# EasyEDA Pro project 2025-04-22-OSSC PRO HW with layout-v00.epro

# Schematic afe_audio
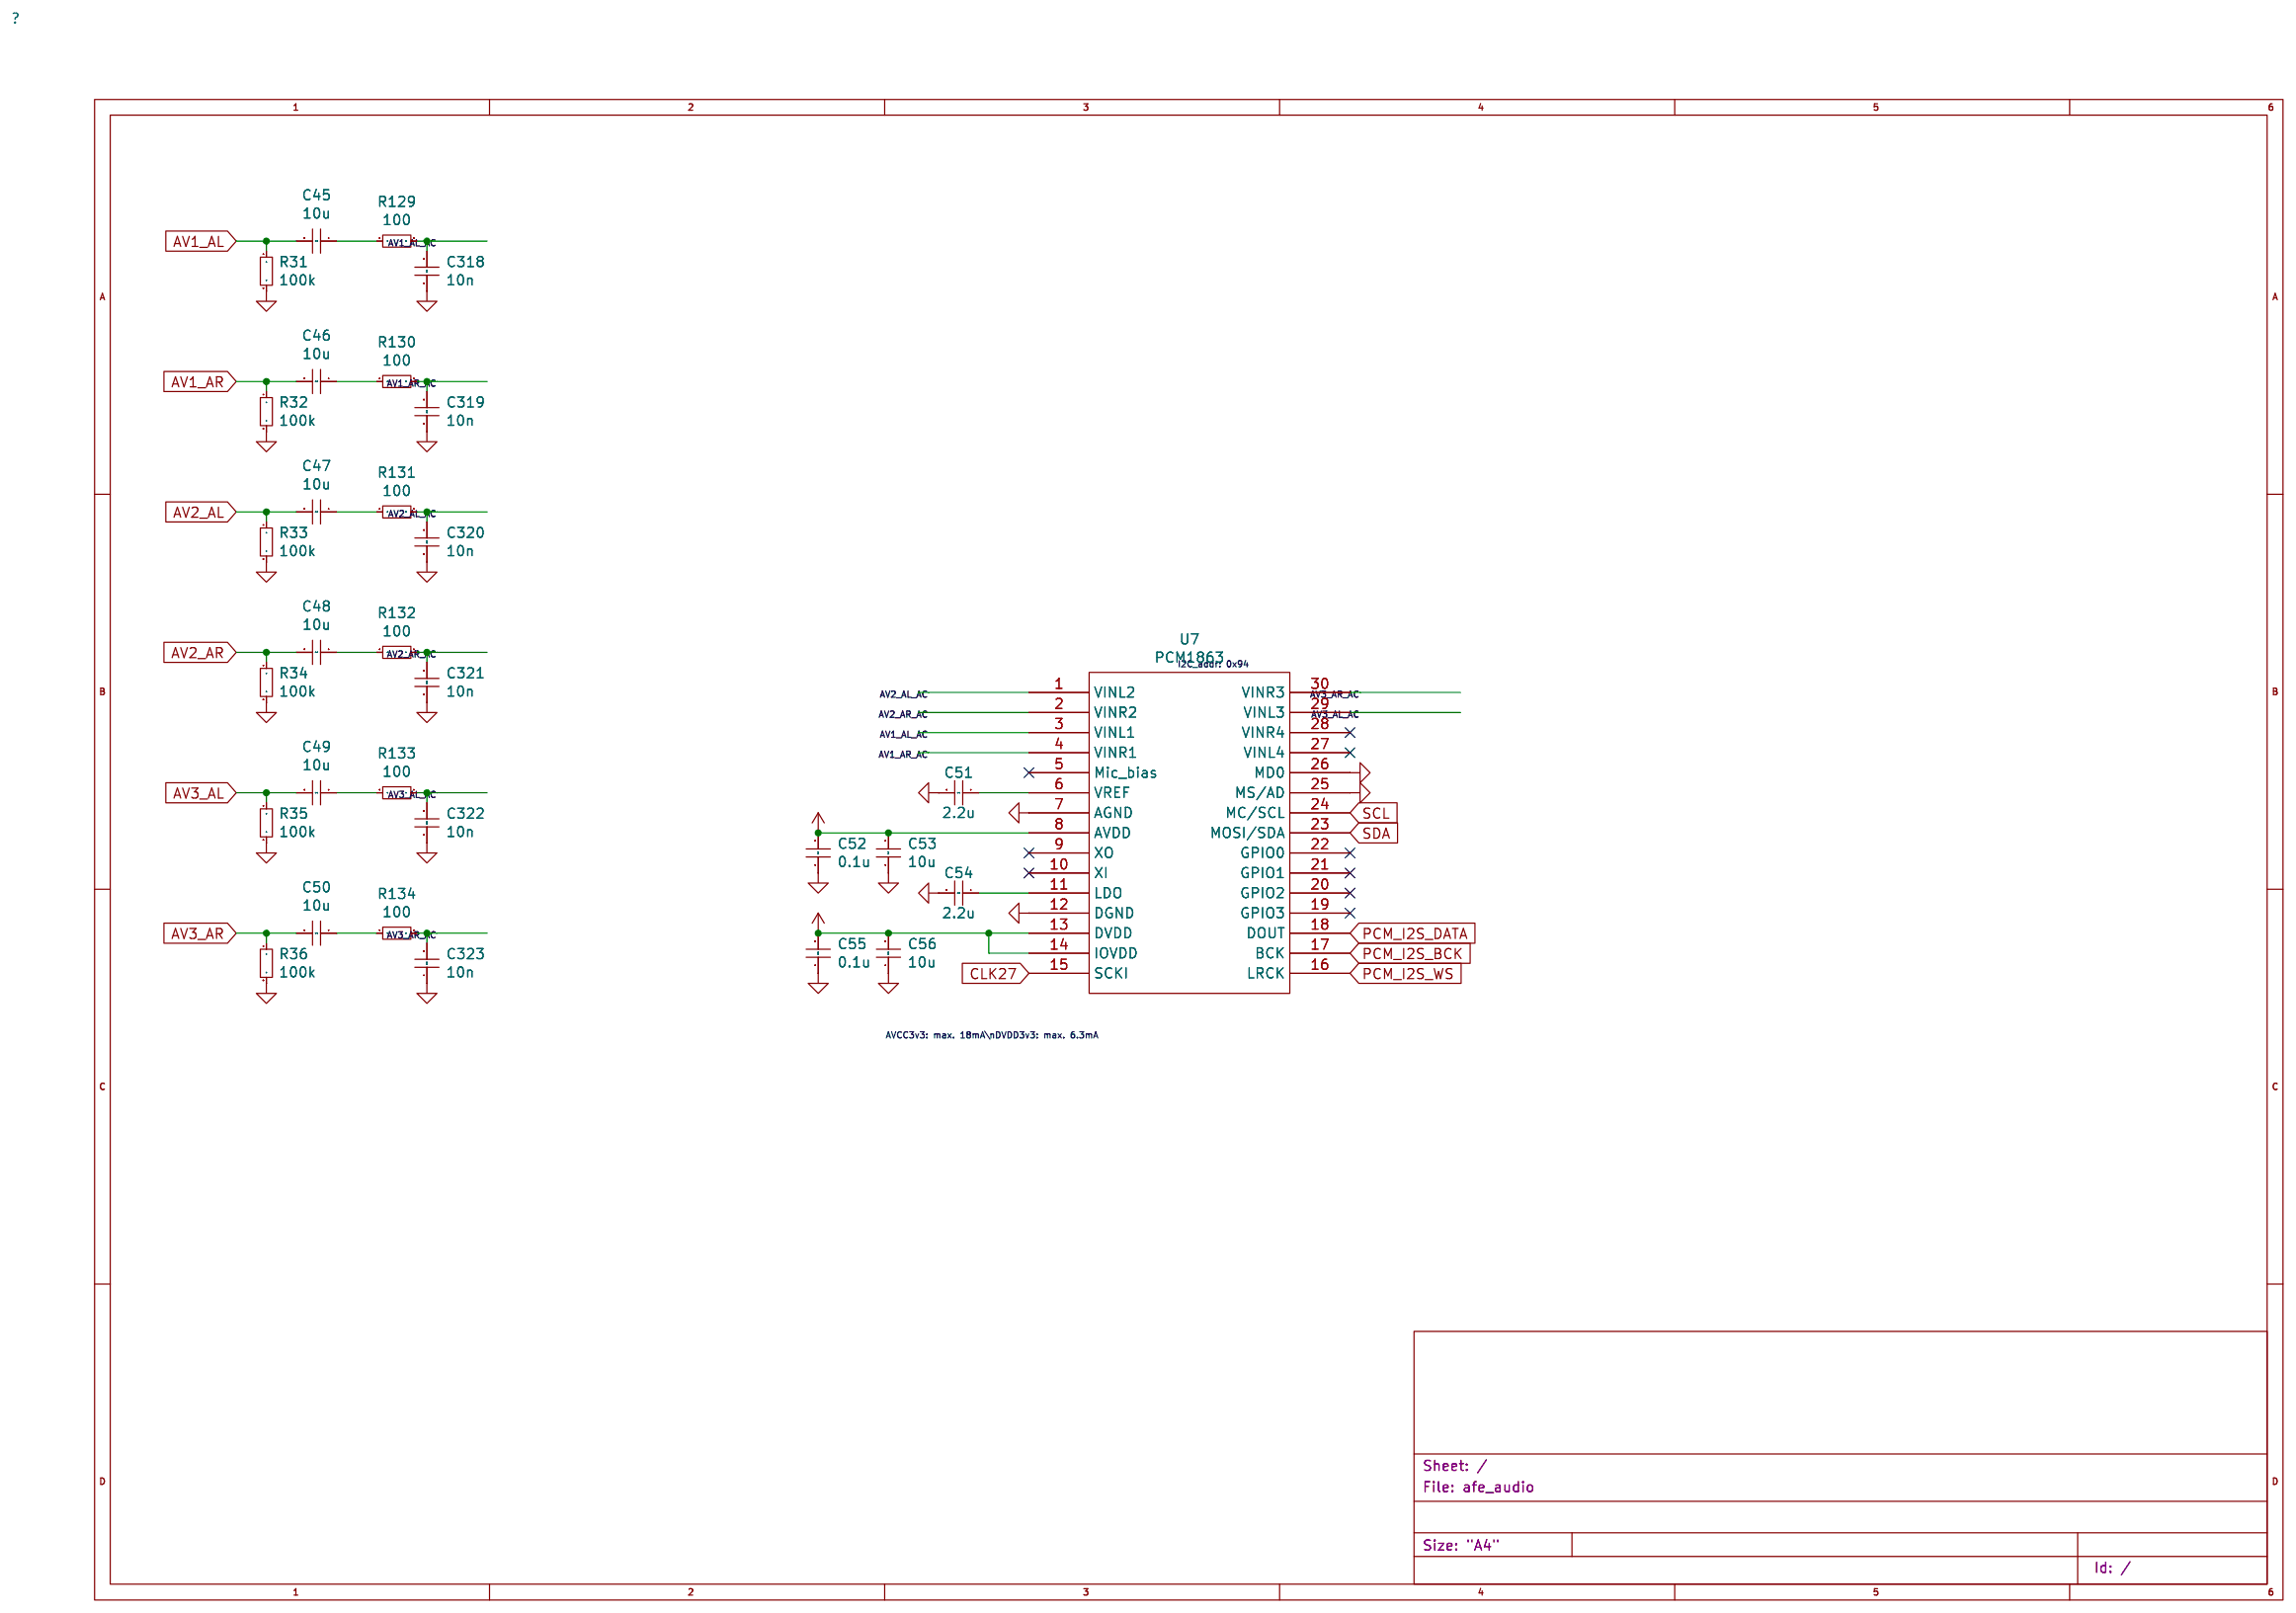
[diagram p0: schematic sheet]

## Parts
C45  10u
C46  10u
C47  10u
C48  10u
C49  10u
C50  10u
C51  2.2u
C52  0.1u
C53  10u
C54  2.2u
C55  0.1u
C56  10u
C318  10n
C319  10n
C320  10n
C321  10n
C322  10n
C323  10n
R31  100k
R32  100k
R33  100k
R34  100k
R35  100k
R36  100k
R129  100
R130  100
R131  100
R132  100
R133  100
R134  100
U7  PCM1863  [Package_SO:TSSOP-30_4.4x7.8mm_P0.5mm]

## Library data of the parts
C45-C56 C318-C323 = Device_C_Small
R31-R36 R129-R134 = Device_R_Small
U7 = custom_components_PCM1862: User doc link: DOCUMENTATION

## Nets
AV1_AL: C45.2 R31.1
AV1_AL_AC: C318.2 R129.1 U7.3(VINL1)
AV1_AR: C46.2 R32.1
AV1_AR_AC: C319.2 R130.1 U7.4(VINR1)
AV2_AL: C47.2 R33.1
AV2_AL_AC: C320.2 R131.1 U7.1(VINL2)
AV2_AR: C48.2 R34.1
AV2_AR_AC: C321.2 R132.1 U7.2(VINR2)
AV3_AL: C49.2 R35.1
AV3_AL_AC: C322.2 R133.1 U7.29(VINL3)
AV3_AR: C50.2 R36.1
AV3_AR_AC: C323.2 R134.1 U7.30(VINR3)
CLK27: U7.15(SCKI)
CUSTOM_COMPONENTS_AVCC3V3: C52.2 C53.2 U7.8(AVDD)
CUSTOM_COMPONENTS_DVDD3V3: C55.2 C56.2 U7.13(DVDD) U7.14(IOVDD)
PCM_I2S_BCK: U7.17(BCK)
PCM_I2S_DATA: U7.18(DOUT)
PCM_I2S_WS: U7.16(LRCK)
POWER_GND: C51.2 C52.1 C53.1 C54.2 C55.1 C56.1 C318.1 C319.1 C320.1 C321.1 C322.1 C323.1 R31.2 R32.2 R33.2 R34.2 R35.2 R36.2 U7.7(AGND) U7.12(DGND) U7.25(MS/AD) U7.26(MD0)
SCL: U7.24(MC/SCL)
SDA: U7.23(MOSI/SDA)
Net-(C45-1): C45.1 R129.2
Net-(C46-1): C46.1 R130.2
Net-(C47-1): C47.1 R131.2
Net-(C48-1): C48.1 R132.2
Net-(C49-1): C49.1 R133.2
Net-(C50-1): C50.1 R134.2
Net-(C51-1): C51.1 U7.6(VREF)
Net-(C54-1): C54.1 U7.11(LDO)

Not connected (* = marked no-connect by the designer): U7 5(Mic_bias)* 9(XO)* 10(XI)* 19(GPIO3)* 20(GPIO2)* 21(GPIO1)* 22(GPIO0)* 27(VINL4)* 28(VINR4)*

## Notes on the sheet
- I2C_addr: 0x94
- AVCC3v3: max. 18mA\nDVDD3v3: max. 6.3mA

# Schematic afe_rgb
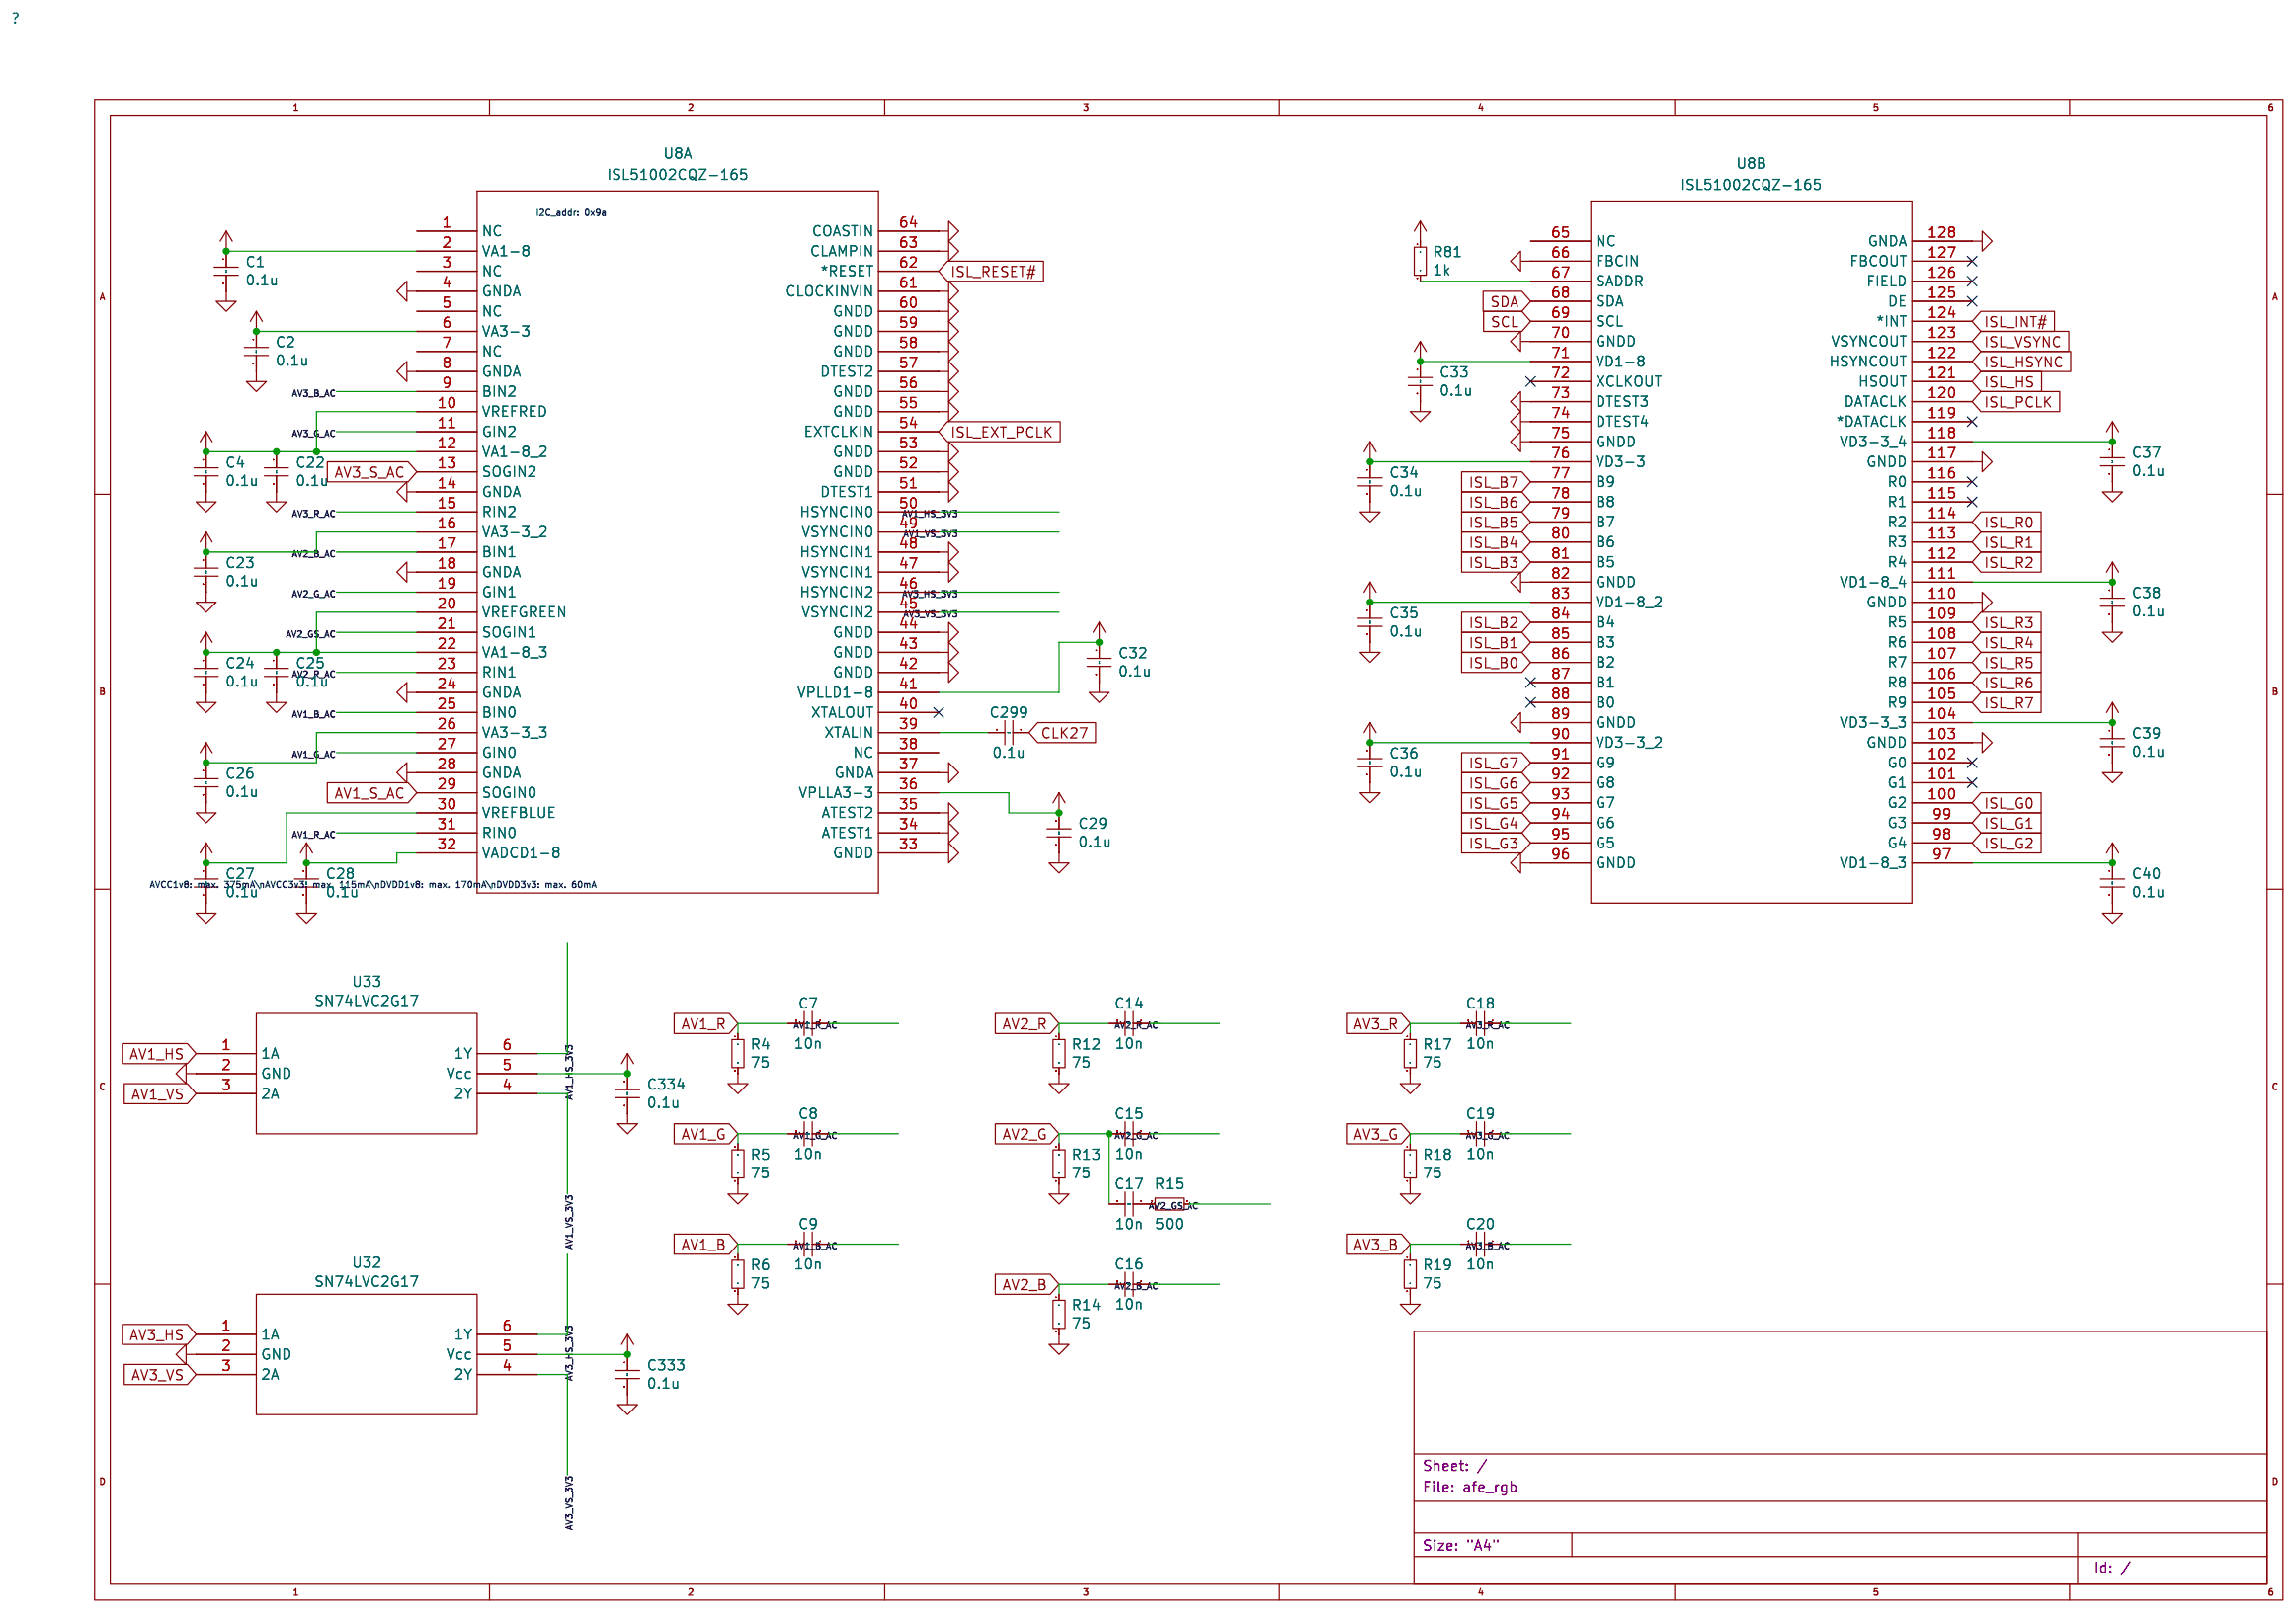
[diagram p1: schematic sheet]

## Parts
C1  0.1u
C2  0.1u
C4  0.1u
C7  10n
C8  10n
C9  10n
C14  10n
C15  10n
C16  10n
C17  10n
C18  10n
C19  10n
C20  10n
C22  0.1u
C23  0.1u
C24  0.1u
C25  0.1u
C26  0.1u
C27  0.1u
C28  0.1u
C29  0.1u
C32  0.1u
C33  0.1u
C34  0.1u
C35  0.1u
C36  0.1u
C37  0.1u
C38  0.1u
C39  0.1u
C40  0.1u
C299  0.1u
C333  0.1u
C334  0.1u
R4  75
R5  75
R6  75
R12  75
R13  75
R14  75
R15  500
R17  75
R18  75
R19  75
R81  1k
U8  ISL51002CQZ-165  (sections 1,2)
U32  SN74LVC2G17  [Package_TO_SOT_SMD:SC-70-8]
U33  SN74LVC2G17

## Library data of the parts
C1 C2 C4 C7-C9 C14-C20 C22-C29 C32-C40 C299 C333 C334 = Device_C_Small
R4-R6 R12-R15 R17-R19 R81 = Device_R_Small
U8 = custom_components_ISL51002CQZ-165
U32 = custom_components_SN74LVC2G17_1: User doc link: DOCUMENTATION
U33 = custom_components_SN74LVC2G17: User doc link: DOCUMENTATION

## Nets
AV1_B: C9.2 R6.1
AV1_B_AC: C9.1 U8.25(BIN0)
AV1_G: C8.2 R5.1
AV1_G_AC: C8.1 U8.27(GIN0)
AV1_HS: U33.1(1A)
AV1_HS_3V3: U8.50(HSYNCIN0) U33.6(1Y)
AV1_R: C7.2 R4.1
AV1_R_AC: C7.1 U8.31(RIN0)
AV1_S_AC: U8.29(SOGIN0)
AV1_VS: U33.3(2A)
AV1_VS_3V3: U8.49(VSYNCIN0) U33.4(2Y)
AV2_B: C16.2 R14.1
AV2_B_AC: C16.1 U8.17(BIN1)
AV2_G: C15.2 C17.2 R13.1
AV2_G_AC: C15.1 U8.19(GIN1)
AV2_GS_AC: R15.1 U8.21(SOGIN1)
AV2_R: C14.2 R12.1
AV2_R_AC: C14.1 U8.23(RIN1)
AV3_B: C20.2 R19.1
AV3_B_AC: C20.1 U8.9(BIN2)
AV3_G: C19.2 R18.1
AV3_G_AC: C19.1 U8.11(GIN2)
AV3_HS: U32.1(1A)
AV3_HS_3V3: U8.46(HSYNCIN2) U32.6(1Y)
AV3_R: C18.2 R17.1
AV3_R_AC: C18.1 U8.15(RIN2)
AV3_S_AC: U8.13(SOGIN2)
AV3_VS: U32.3(2A)
AV3_VS_3V3: U8.45(VSYNCIN2) U32.4(2Y)
CLK27: C299.1
CUSTOM_COMPONENTS_AVCC1V8: C1.1 C4.1 C22.1 C24.1 C25.1 C27.1 U8.2(VA1-8) U8.10(VREFRED) U8.12(VA1-8_2) U8.20(VREFGREEN) U8.22(VA1-8_3) U8.30(VREFBLUE)
CUSTOM_COMPONENTS_AVCC3V3: C2.1 C23.1 C26.1 C29.1 U8.6(VA3-3) U8.16(VA3-3_2) U8.26(VA3-3_3) U8.36(VPLLA3-3)
CUSTOM_COMPONENTS_DVDD1V8: C28.1 C32.1 C33.1 C35.1 C38.1 C40.1 U8.32(VADCD1-8) U8.41(VPLLD1-8) U8.71(VD1-8) U8.83(VD1-8_2) U8.97(VD1-8_3) U8.111(VD1-8_4)
CUSTOM_COMPONENTS_DVDD3V3: C34.1 C36.1 C37.1 C39.1 C333.1 C334.1 R81.1 U8.76(VD3-3) U8.90(VD3-3_2) U8.104(VD3-3_3) U8.118(VD3-3_4) U32.5(Vcc) U33.5(Vcc)
ISL_B0: U8.86(B2)
ISL_B1: U8.85(B3)
ISL_B2: U8.84(B4)
ISL_B3: U8.81(B5)
ISL_B4: U8.80(B6)
ISL_B5: U8.79(B7)
ISL_B6: U8.78(B8)
ISL_B7: U8.77(B9)
ISL_EXT_PCLK: U8.54(EXTCLKIN)
ISL_G0: U8.100(G2)
ISL_G1: U8.99(G3)
ISL_G2: U8.98(G4)
ISL_G3: U8.95(G5)
ISL_G4: U8.94(G6)
ISL_G5: U8.93(G7)
ISL_G6: U8.92(G8)
ISL_G7: U8.91(G9)
ISL_HS: U8.121(HSOUT)
ISL_HSYNC: U8.122(HSYNCOUT)
ISL_INT#: U8.124(*INT)
ISL_PCLK: U8.120(DATACLK)
ISL_R0: U8.114(R2)
ISL_R1: U8.113(R3)
ISL_R2: U8.112(R4)
ISL_R3: U8.109(R5)
ISL_R4: U8.108(R6)
ISL_R5: U8.107(R7)
ISL_R6: U8.106(R8)
ISL_R7: U8.105(R9)
ISL_RESET#: U8.62(*RESET)
ISL_VSYNC: U8.123(VSYNCOUT)
POWER_GND: C1.2 C2.2 C4.2 C22.2 C23.2 C24.2 C25.2 C26.2 C27.2 C28.2 C29.2 C32.2 C33.2 C34.2 C35.2 C36.2 C37.2 C38.2 C39.2 C40.2 C333.2 C334.2 R4.2 R5.2 R6.2 R12.2 R13.2 R14.2 R17.2 R18.2 R19.2 U8.4(GNDA) U8.8(GNDA) U8.14(GNDA) U8.18(GNDA) U8.24(GNDA) U8.28(GNDA) U8.33(GNDD) U8.34(ATEST1) U8.35(ATEST2) U8.37(GNDA) U8.42(GNDD) U8.43(GNDD) U8.44(GNDD) U8.47(VSYNCIN1) U8.48(HSYNCIN1) U8.51(DTEST1) U8.52(GNDD) U8.53(GNDD) U8.55(GNDD) U8.56(GNDD) U8.57(DTEST2) U8.58(GNDD) U8.59(GNDD) U8.60(GNDD) U8.61(CLOCKINVIN) U8.63(CLAMPIN) U8.64(COASTIN) U8.66(FBCIN) U8.70(GNDD) U8.73(DTEST3) U8.74(DTEST4) U8.75(GNDD) U8.82(GNDD) U8.89(GNDD) U8.96(GNDD) U8.103(GNDD) U8.110(GNDD) U8.117(GNDD) U8.128(GNDA) U32.2(GND) U33.2(GND)
SCL: U8.69(SCL)
SDA: U8.68(SDA)
Net-(C17-1): C17.1 R15.2
Net-(C299-2): C299.2 U8.39(XTALIN)
Net-(R81-2): R81.2 U8.67(SADDR)

Not connected (* = marked no-connect by the designer): U8 1(NC) 3(NC) 5(NC) 7(NC) 38(NC) 40(XTALOUT)* 65(NC) 72(XCLKOUT)* 87(B1)* 88(B0)* 101(G1)* 102(G0)* 115(R1)* 116(R0)* 119(*DATACLK)* 125(DE)* 126(FIELD)* 127(FBCOUT)*

## Notes on the sheet
- I2C_addr: 0x9a
- AVCC1v8: max. 375mA\nAVCC3v3: max. 115mA\nDVDD1v8: max. 170mA\nDVDD3v3: max. 60mA

# Schematic afe_syncmux
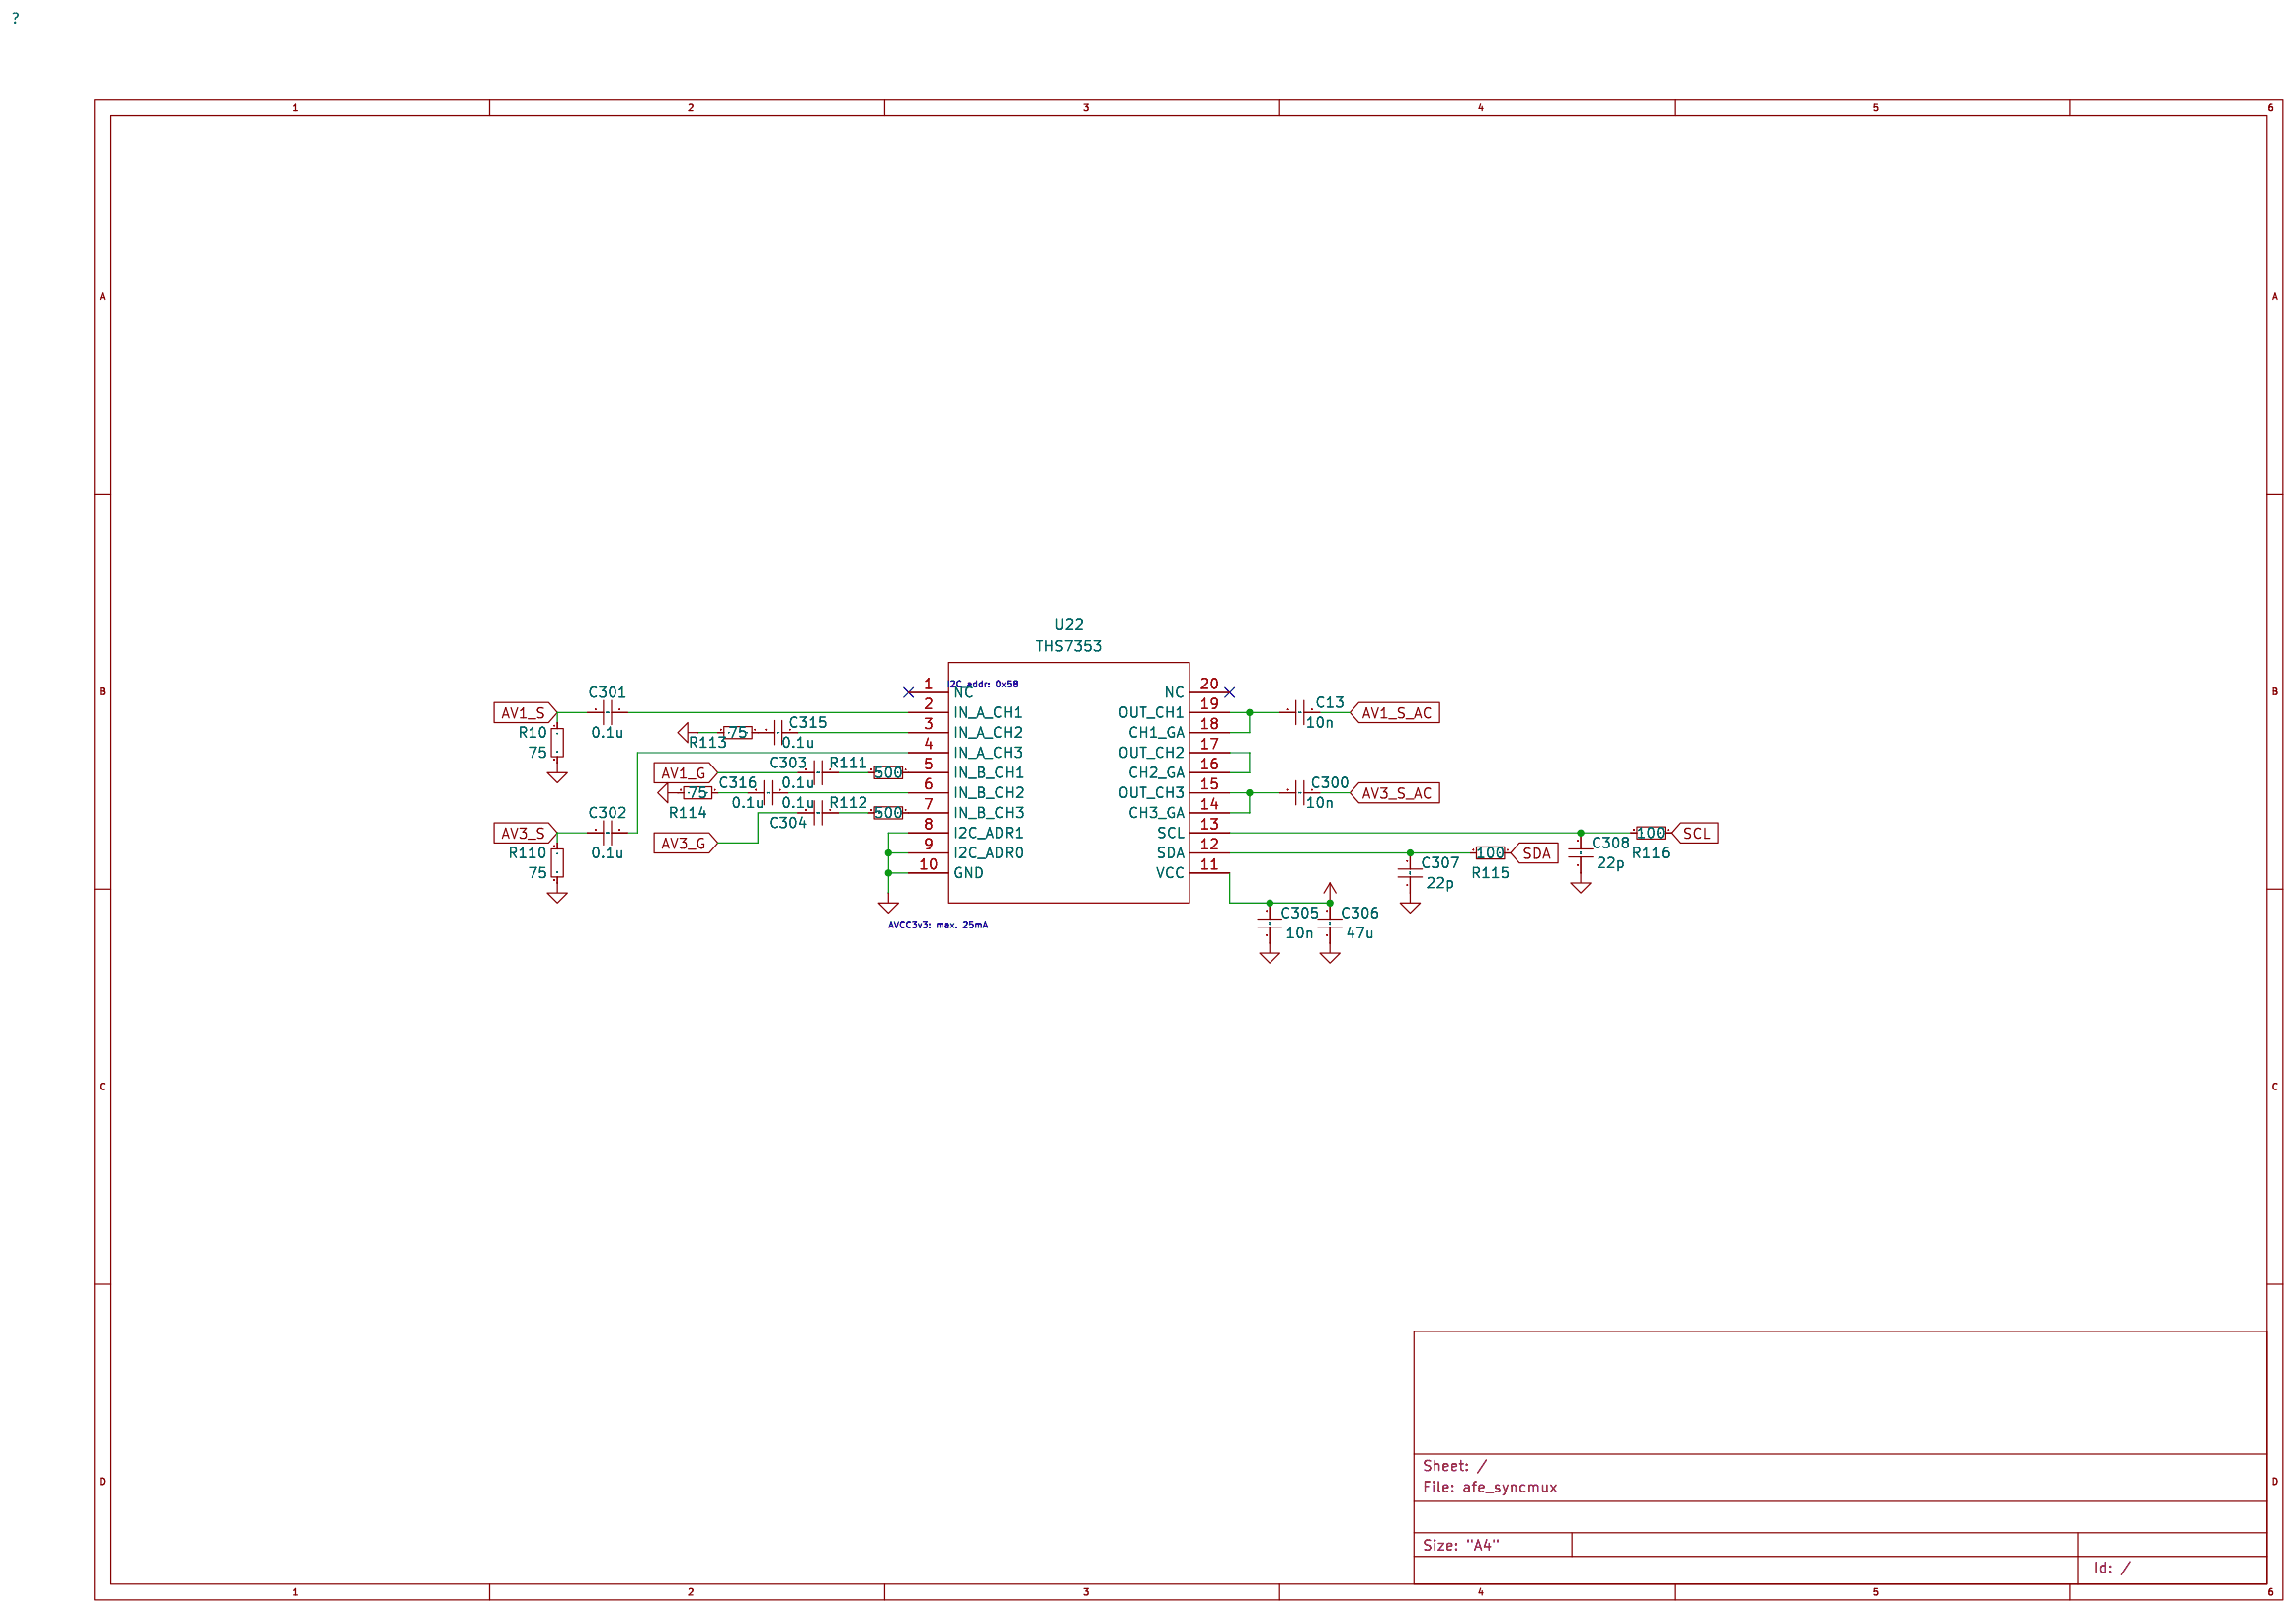
[diagram p2: schematic sheet]

## Parts
C13  10n
C300  10n
C301  0.1u
C302  0.1u
C303  0.1u
C304  0.1u
C305  10n
C306  47u
C307  22p
C308  22p
C315  0.1u
C316  0.1u
R10  75
R110  75
R111  500
R112  500
R113  75
R114  75
R115  100
R116  100
U22  THS7353  [Package_SO:TSSOP-20_4.4x6.5mm_P0.65mm]

## Library data of the parts
C13 C300-C308 C315 C316 = Device_C_Small
R10 R110-R116 = Device_R_Small
U22 = custom_components_THS7353

## Nets
AV1_G: C303.2
AV1_S: C301.2 R10.1
AV1_S_AC: C13.1
AV3_G: C304.2
AV3_S: C302.2 R110.1
AV3_S_AC: C300.1
CUSTOM_COMPONENTS_AVCC3V3: C305.2 C306.2 U22.11(VCC)
POWER_GND: C305.1 C306.1 C307.1 C308.1 R10.2 R110.2 R113.2 R114.2 U22.8(I2C_ADR1) U22.9(I2C_ADR0) U22.10(GND)
SCL: R116.1
SDA: R115.1
Net-(C13-2): C13.2 U22.18(CH1_GA) U22.19(OUT_CH1)
Net-(C300-2): C300.2 U22.14(CH3_GA) U22.15(OUT_CH3)
Net-(C301-1): C301.1 U22.2(IN_A_CH1)
Net-(C302-1): C302.1 U22.4(IN_A_CH3)
Net-(C303-1): C303.1 R111.2
Net-(C304-1): C304.1 R112.2
Net-(C307-2): C307.2 R115.2 U22.12(SDA)
Net-(C308-2): C308.2 R116.2 U22.13(SCL)
Net-(C315-1): C315.1 U22.3(IN_A_CH2)
Net-(C315-2): C315.2 R113.1
Net-(C316-1): C316.1 U22.6(IN_B_CH2)
Net-(C316-2): C316.2 R114.1
Net-(R111-1): R111.1 U22.5(IN_B_CH1)
Net-(R112-1): R112.1 U22.7(IN_B_CH3)
Net-(U22-16): U22.16(CH2_GA) U22.17(OUT_CH2)

Not connected (* = marked no-connect by the designer): U22 1(NC)* 20(NC)*

## Notes on the sheet
- I2C_addr: 0x58
- AVCC3v3: max. 25mA

# Schematic clock
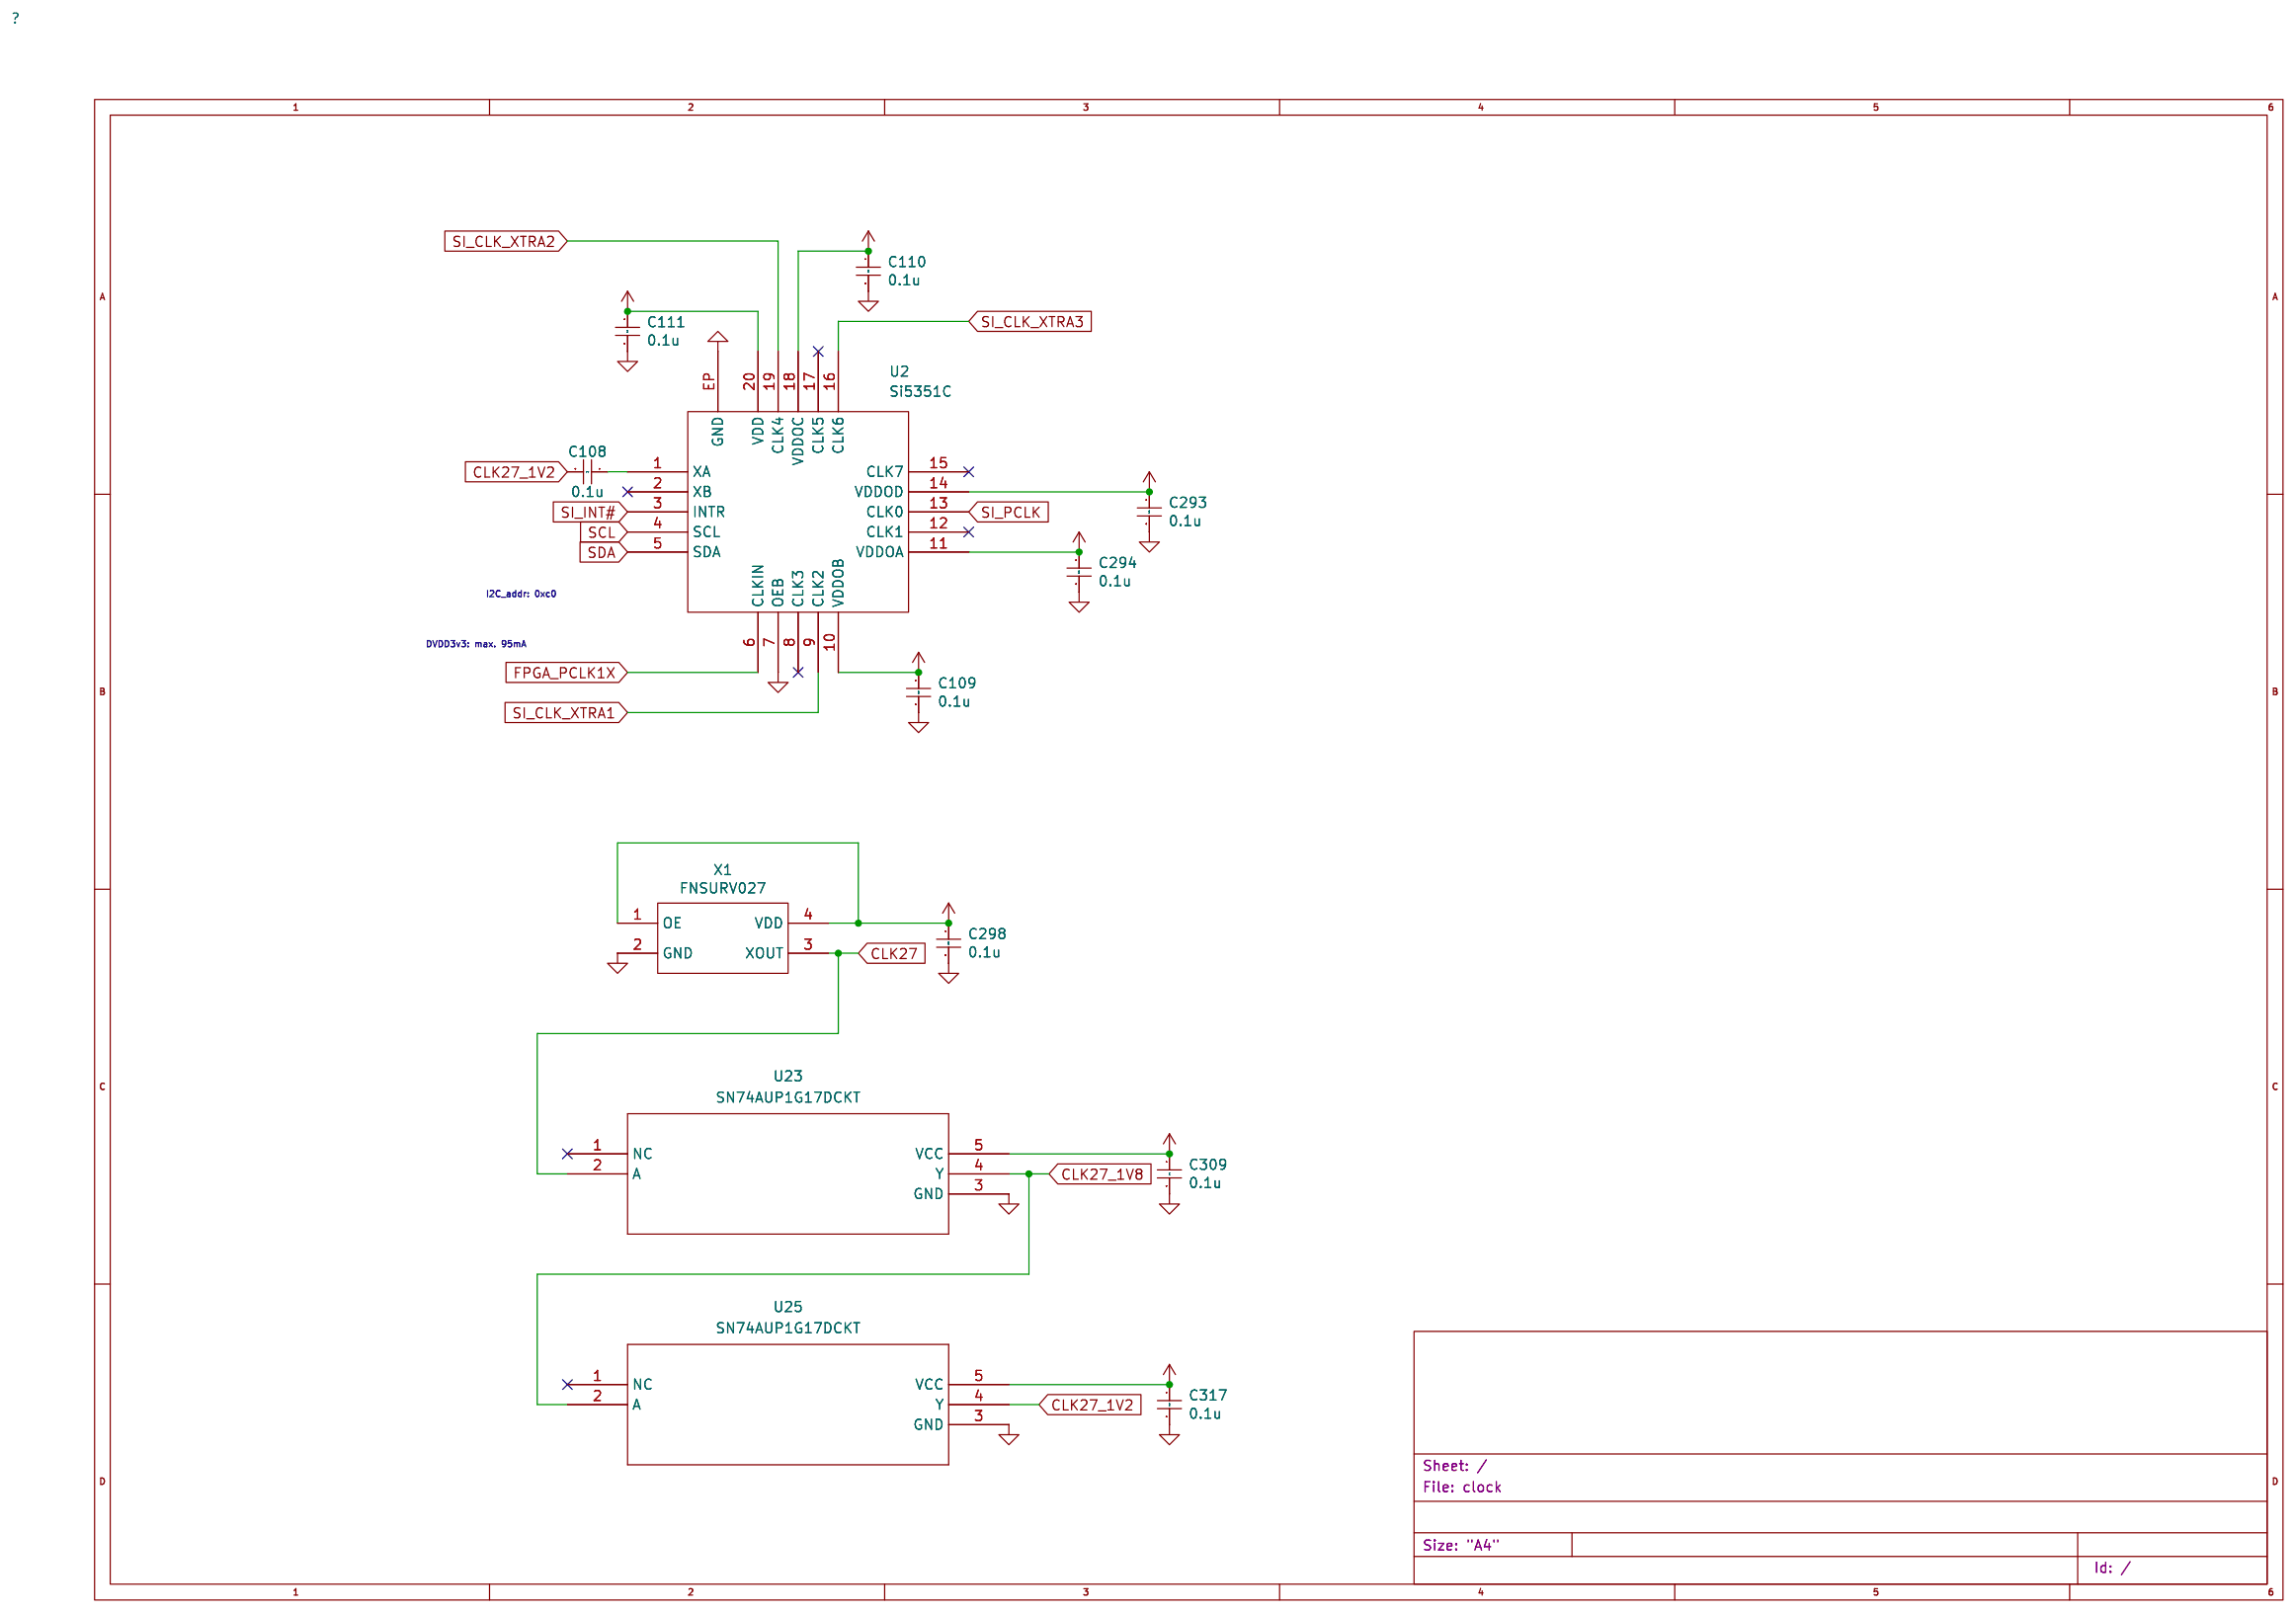
[diagram p3: schematic sheet]

## Parts
C108  0.1u
C109  0.1u
C110  0.1u
C111  0.1u
C293  0.1u
C294  0.1u
C298  0.1u
C309  0.1u
C317  0.1u
U2  Si5351C  [custom_components:QFN-20-1EP_4x4mm_Pitch0.5mm_Handsoldering]
U23  SN74AUP1G17DCKT
U25  SN74AUP1G17DCKT  [custom_components:SN74AUP1G17DCKT]
X1  FNSURV027  [Connector_PinHeader_2.54mm:PinHeader_2x02_P2.54mm_Vertical]

## Library data of the parts
C108-C111 C293 C294 C298 C309 C317 = Device_C_Small
U2 = custom_components_Si5351C
U23 = custom_components_SN74AUP1G17DCKT
U25 = custom_components_SN74AUP1G17DCKT_1
X1 = custom_components_FNSURV027

## Nets
CLK27: U23.2(A) X1.3(XOUT)
CLK27_1V2: C108.2 U25.4(Y)
CLK27_1V8: U23.4(Y) U25.2(A)
CUSTOM_COMPONENTS_DVDD1V2: C317.1 U25.5(VCC)
CUSTOM_COMPONENTS_DVDD1V8: C309.1 U23.5(VCC)
CUSTOM_COMPONENTS_DVDD3V3: C109.1 C110.1 C111.1 C293.1 C294.1 C298.1 U2.10(VDDOB) U2.11(VDDOA) U2.14(VDDOD) U2.18(VDDOC) U2.20(VDD) X1.1(OE) X1.4(VDD)
FPGA_PCLK1X: U2.6(CLKIN)
POWER_GND: C109.2 C110.2 C111.2 C293.2 C294.2 C298.2 C309.2 C317.2 U2.7(OEB) U2.EP(GND) U23.3(GND) U25.3(GND) X1.2(GND)
SCL: U2.4(SCL)
SDA: U2.5(SDA)
SI_CLK_XTRA1: U2.9(CLK2)
SI_CLK_XTRA2: U2.19(CLK4)
SI_CLK_XTRA3: U2.16(CLK6)
SI_INT#: U2.3(INTR)
SI_PCLK: U2.13(CLK0)
Net-(C108-1): C108.1 U2.1(XA)

Not connected (* = marked no-connect by the designer): U2 2(XB)* 8(CLK3)* 12(CLK1)* 15(CLK7)* 17(CLK5)*; U23 1(NC)*; U25 1(NC)*

## Notes on the sheet
- I2C_addr: 0xc0
- DVDD3v3: max. 95mA

# Schematic fpga1
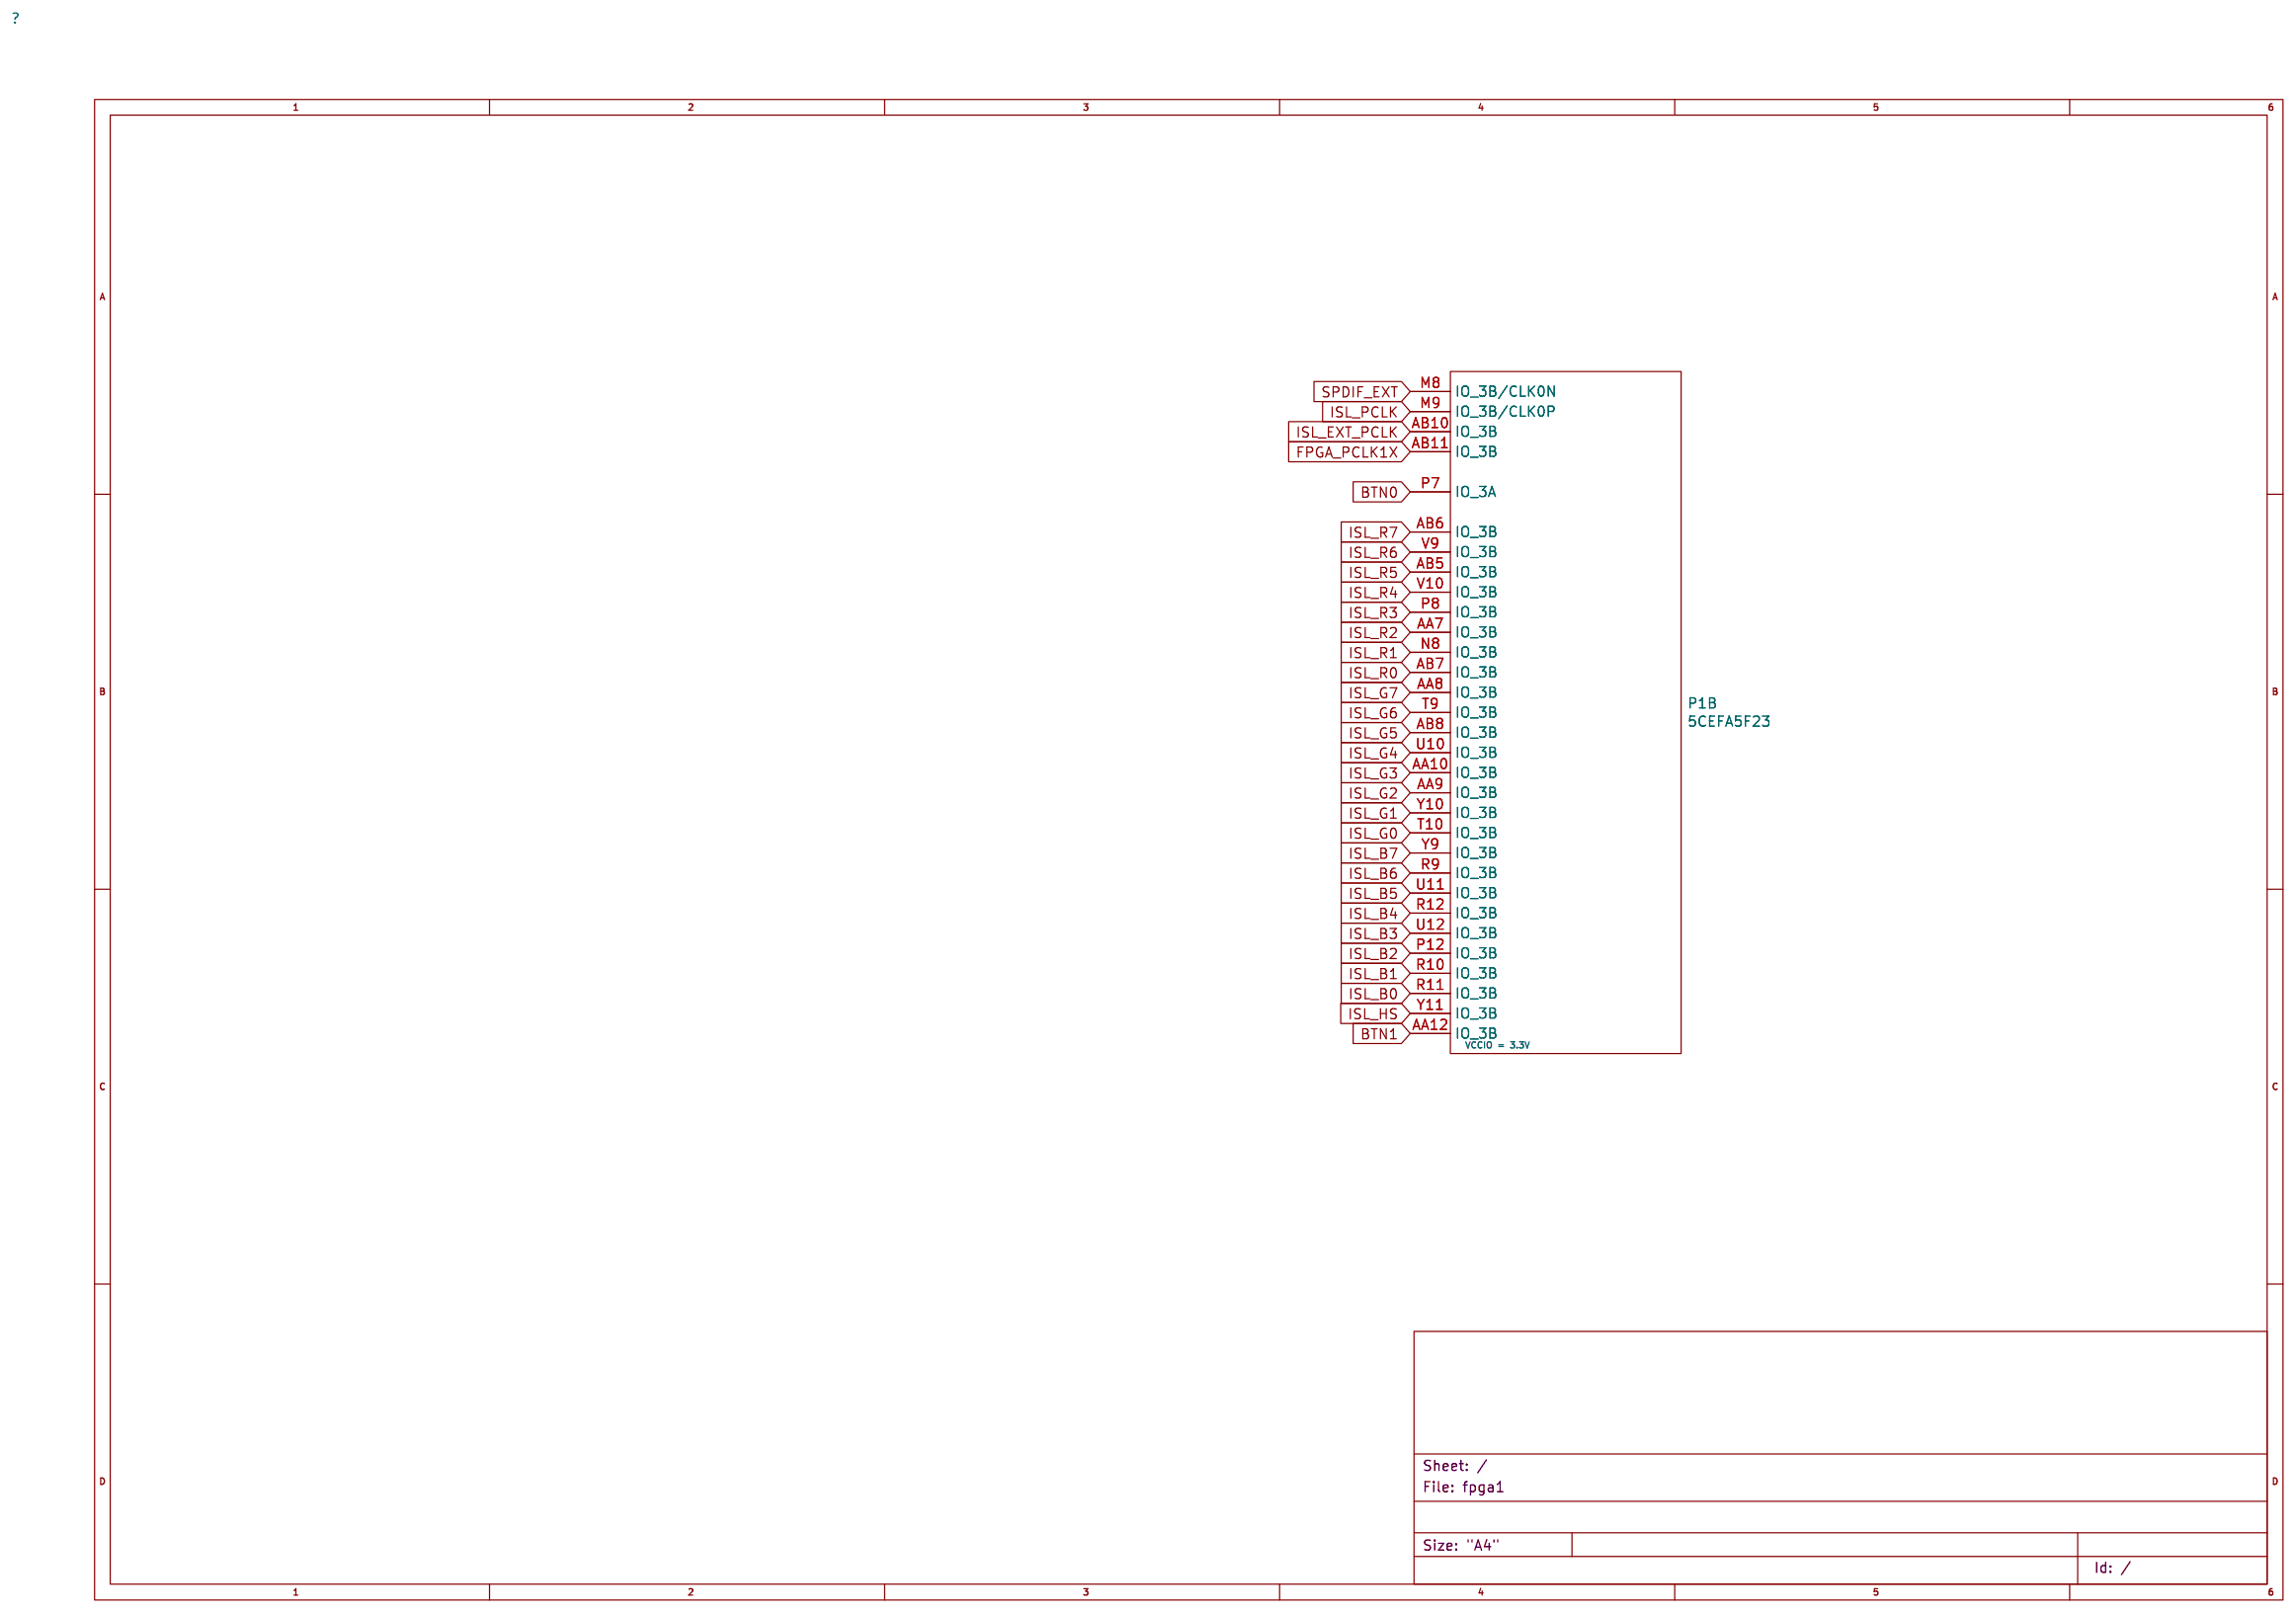
[diagram p4: schematic sheet]

## Parts
P1  5CEFA5F23  (section 2)

## Library data of the parts
P1 = custom_components_5CEFA5F23

## Nets
BTN0: P1.P7(IO_3A)
BTN1: P1.AA12(IO_3B)
FPGA_PCLK1X: P1.AB11(IO_3B)
ISL_B0: P1.R11(IO_3B)
ISL_B1: P1.R10(IO_3B)
ISL_B2: P1.P12(IO_3B)
ISL_B3: P1.U12(IO_3B)
ISL_B4: P1.R12(IO_3B)
ISL_B5: P1.U11(IO_3B)
ISL_B6: P1.R9(IO_3B)
ISL_B7: P1.Y9(IO_3B)
ISL_EXT_PCLK: P1.AB10(IO_3B)
ISL_G0: P1.T10(IO_3B)
ISL_G1: P1.Y10(IO_3B)
ISL_G2: P1.AA9(IO_3B)
ISL_G3: P1.AA10(IO_3B)
ISL_G4: P1.U10(IO_3B)
ISL_G5: P1.AB8(IO_3B)
ISL_G6: P1.T9(IO_3B)
ISL_G7: P1.AA8(IO_3B)
ISL_HS: P1.Y11(IO_3B)
ISL_PCLK: P1.M9(IO_3B/CLK0P)
ISL_R0: P1.AB7(IO_3B)
ISL_R1: P1.N8(IO_3B)
ISL_R2: P1.AA7(IO_3B)
ISL_R3: P1.P8(IO_3B)
ISL_R4: P1.V10(IO_3B)
ISL_R5: P1.AB5(IO_3B)
ISL_R6: P1.V9(IO_3B)
ISL_R7: P1.AB6(IO_3B)
SPDIF_EXT: P1.M8(IO_3B/CLK0N)

## Notes on the sheet
- VCCIO = 3.3V

# Schematic fpga2
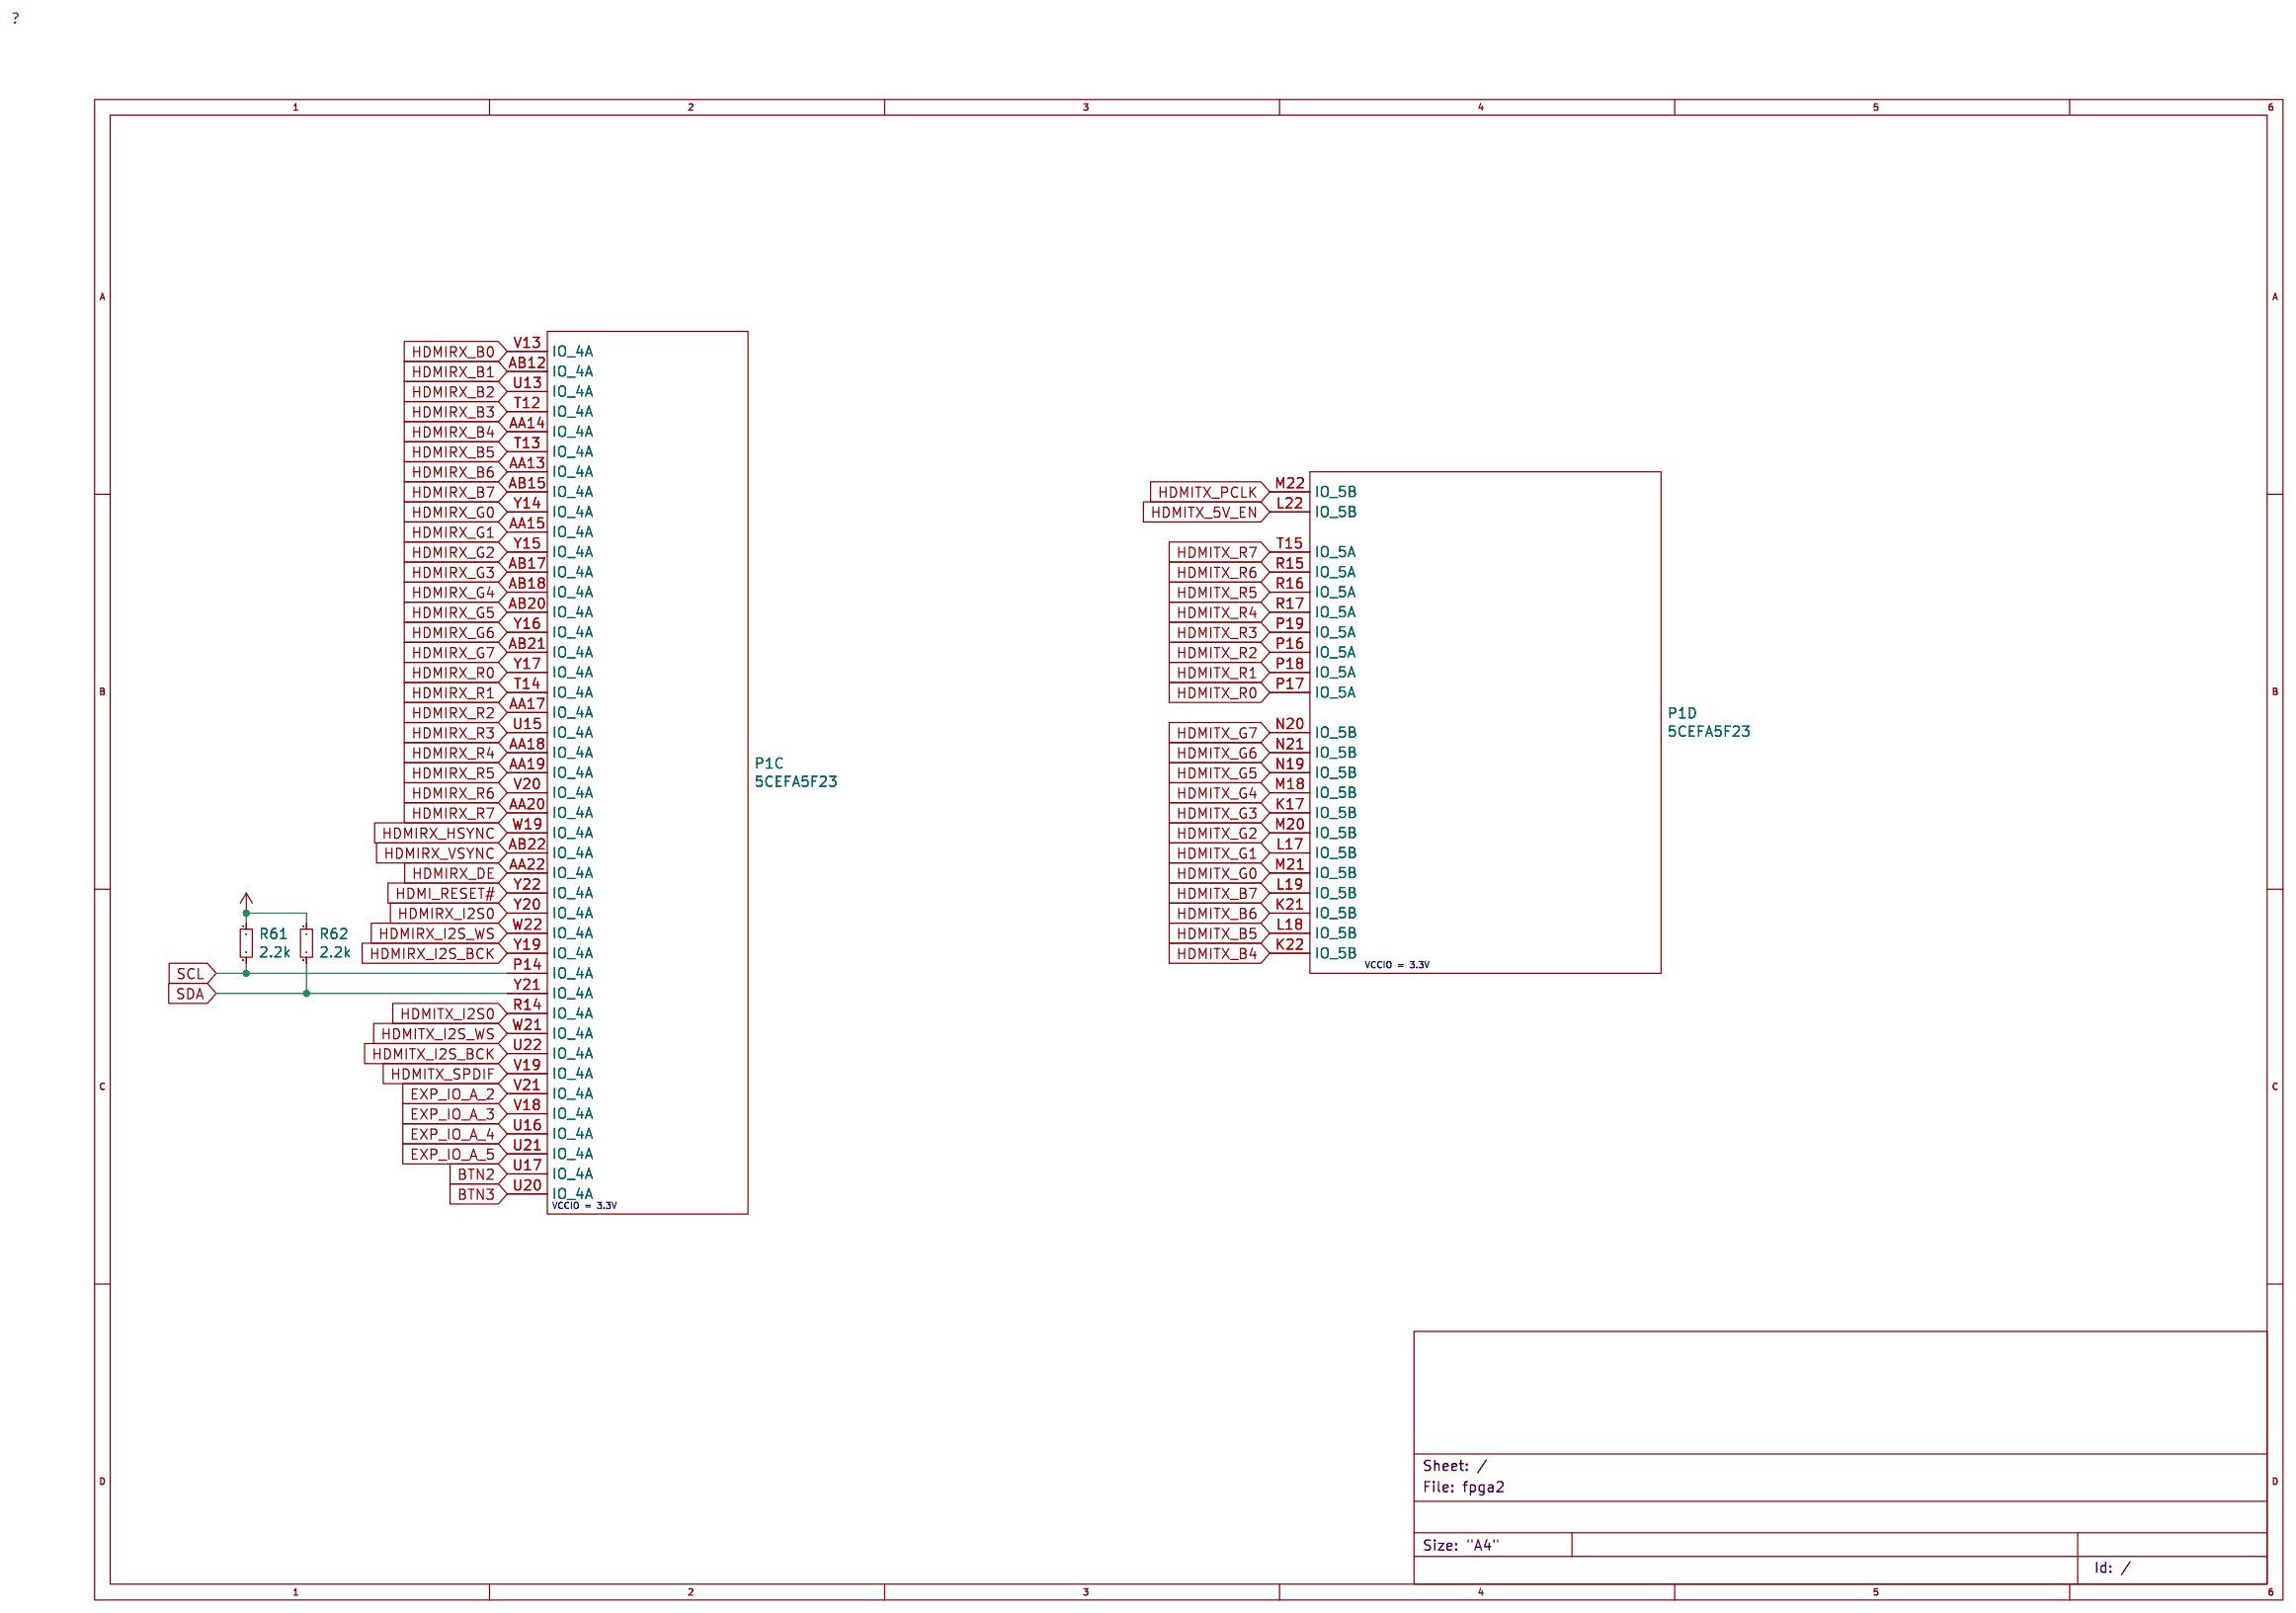
[diagram p5: schematic sheet]

## Parts
P1  5CEFA5F23  (sections 3,4)
R61  2.2k
R62  2.2k

## Library data of the parts
P1 = custom_components_5CEFA5F23
R61 R62 = Device_R_Small

## Nets
BTN2: P1.U17(IO_4A)
BTN3: P1.U20(IO_4A)
CUSTOM_COMPONENTS_DVDD3V3: R61.1 R62.1
EXP_IO_A_2: P1.V21(IO_4A)
EXP_IO_A_3: P1.V18(IO_4A)
EXP_IO_A_4: P1.U16(IO_4A)
EXP_IO_A_5: P1.U21(IO_4A)
HDMI_RESET#: P1.Y22(IO_4A)
HDMIRX_B0: P1.V13(IO_4A)
HDMIRX_B1: P1.AB12(IO_4A)
HDMIRX_B2: P1.U13(IO_4A)
HDMIRX_B3: P1.T12(IO_4A)
HDMIRX_B4: P1.AA14(IO_4A)
HDMIRX_B5: P1.T13(IO_4A)
HDMIRX_B6: P1.AA13(IO_4A)
HDMIRX_B7: P1.AB15(IO_4A)
HDMIRX_DE: P1.AA22(IO_4A)
HDMIRX_G0: P1.Y14(IO_4A)
HDMIRX_G1: P1.AA15(IO_4A)
HDMIRX_G2: P1.Y15(IO_4A)
HDMIRX_G3: P1.AB17(IO_4A)
HDMIRX_G4: P1.AB18(IO_4A)
HDMIRX_G5: P1.AB20(IO_4A)
HDMIRX_G6: P1.Y16(IO_4A)
HDMIRX_G7: P1.AB21(IO_4A)
HDMIRX_HSYNC: P1.W19(IO_4A)
HDMIRX_I2S0: P1.Y20(IO_4A)
HDMIRX_I2S_BCK: P1.Y19(IO_4A)
HDMIRX_I2S_WS: P1.W22(IO_4A)
HDMIRX_R0: P1.Y17(IO_4A)
HDMIRX_R1: P1.T14(IO_4A)
HDMIRX_R2: P1.AA17(IO_4A)
HDMIRX_R3: P1.U15(IO_4A)
HDMIRX_R4: P1.AA18(IO_4A)
HDMIRX_R5: P1.AA19(IO_4A)
HDMIRX_R6: P1.V20(IO_4A)
HDMIRX_R7: P1.AA20(IO_4A)
HDMIRX_VSYNC: P1.AB22(IO_4A)
HDMITX_5V_EN: P1.L22(IO_5B)
HDMITX_B4: P1.K22(IO_5B)
HDMITX_B5: P1.L18(IO_5B)
HDMITX_B6: P1.K21(IO_5B)
HDMITX_B7: P1.L19(IO_5B)
HDMITX_G0: P1.M21(IO_5B)
HDMITX_G1: P1.L17(IO_5B)
HDMITX_G2: P1.M20(IO_5B)
HDMITX_G3: P1.K17(IO_5B)
HDMITX_G4: P1.M18(IO_5B)
HDMITX_G5: P1.N19(IO_5B)
HDMITX_G6: P1.N21(IO_5B)
HDMITX_G7: P1.N20(IO_5B)
HDMITX_I2S0: P1.R14(IO_4A)
HDMITX_I2S_BCK: P1.U22(IO_4A)
HDMITX_I2S_WS: P1.W21(IO_4A)
HDMITX_PCLK: P1.M22(IO_5B)
HDMITX_R0: P1.P17(IO_5A)
HDMITX_R1: P1.P18(IO_5A)
HDMITX_R2: P1.P16(IO_5A)
HDMITX_R3: P1.P19(IO_5A)
HDMITX_R4: P1.R17(IO_5A)
HDMITX_R5: P1.R16(IO_5A)
HDMITX_R6: P1.R15(IO_5A)
HDMITX_R7: P1.T15(IO_5A)
HDMITX_SPDIF: P1.V19(IO_4A)
SCL: P1.P14(IO_4A) R61.2
SDA: P1.Y21(IO_4A) R62.2

## Notes on the sheet
- VCCIO = 3.3V
- VCCIO = 3.3V

# Schematic fpga3
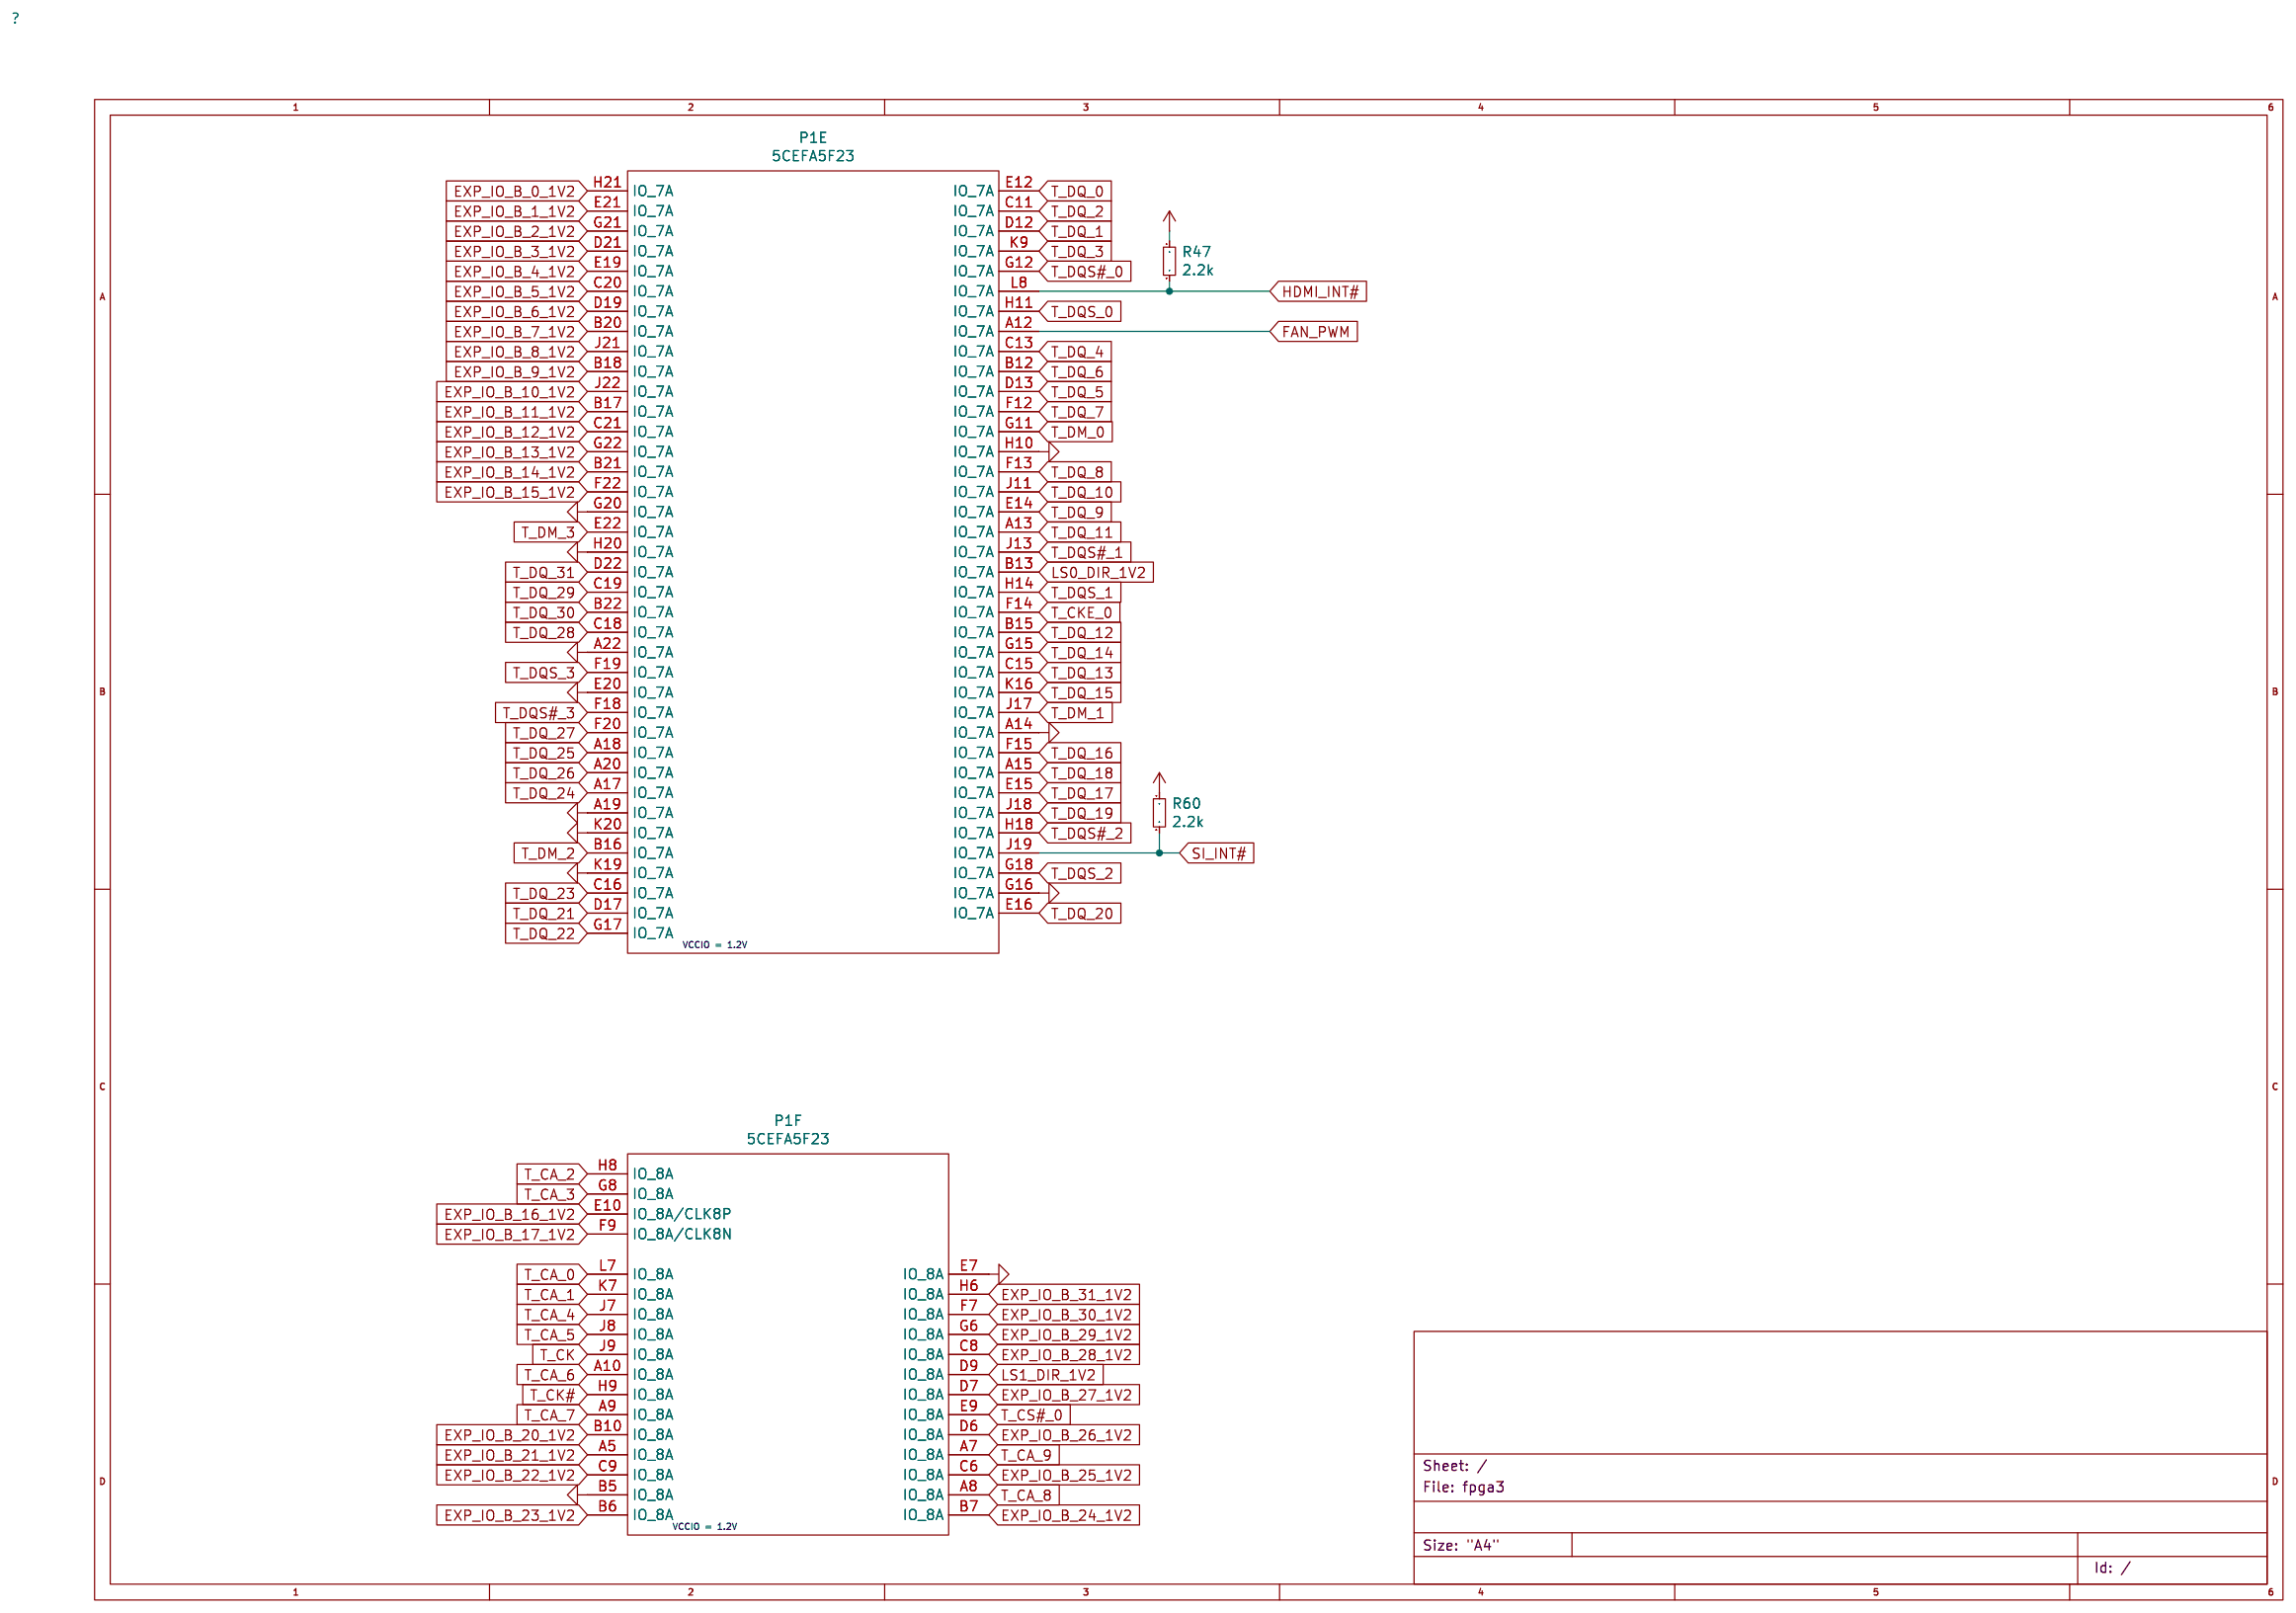
[diagram p6: schematic sheet]

## Parts
P1  5CEFA5F23  (sections 5,6)
R47  2.2k
R60  2.2k

## Library data of the parts
P1 = custom_components_5CEFA5F23
R47 R60 = Device_R_Small

## Nets
CUSTOM_COMPONENTS_DVDD1V2: R47.1 R60.1
EXP_IO_B_0_1V2: P1.H21(IO_7A)
EXP_IO_B_1_1V2: P1.E21(IO_7A)
EXP_IO_B_2_1V2: P1.G21(IO_7A)
EXP_IO_B_3_1V2: P1.D21(IO_7A)
EXP_IO_B_4_1V2: P1.E19(IO_7A)
EXP_IO_B_5_1V2: P1.C20(IO_7A)
EXP_IO_B_6_1V2: P1.D19(IO_7A)
EXP_IO_B_7_1V2: P1.B20(IO_7A)
EXP_IO_B_8_1V2: P1.J21(IO_7A)
EXP_IO_B_9_1V2: P1.B18(IO_7A)
EXP_IO_B_10_1V2: P1.J22(IO_7A)
EXP_IO_B_11_1V2: P1.B17(IO_7A)
EXP_IO_B_12_1V2: P1.C21(IO_7A)
EXP_IO_B_13_1V2: P1.G22(IO_7A)
EXP_IO_B_14_1V2: P1.B21(IO_7A)
EXP_IO_B_15_1V2: P1.F22(IO_7A)
EXP_IO_B_16_1V2: P1.E10(IO_8A/CLK8P)
EXP_IO_B_17_1V2: P1.F9(IO_8A/CLK8N)
EXP_IO_B_20_1V2: P1.B10(IO_8A)
EXP_IO_B_21_1V2: P1.A5(IO_8A)
EXP_IO_B_22_1V2: P1.C9(IO_8A)
EXP_IO_B_23_1V2: P1.B6(IO_8A)
EXP_IO_B_24_1V2: P1.B7(IO_8A)
EXP_IO_B_25_1V2: P1.C6(IO_8A)
EXP_IO_B_26_1V2: P1.D6(IO_8A)
EXP_IO_B_27_1V2: P1.D7(IO_8A)
EXP_IO_B_28_1V2: P1.C8(IO_8A)
EXP_IO_B_29_1V2: P1.G6(IO_8A)
EXP_IO_B_30_1V2: P1.F7(IO_8A)
EXP_IO_B_31_1V2: P1.H6(IO_8A)
FAN_PWM: P1.A12(IO_7A)
HDMI_INT#: P1.L8(IO_7A) R47.2
LS0_DIR_1V2: P1.B13(IO_7A)
LS1_DIR_1V2: P1.D9(IO_8A)
POWER_GND: P1.A14(IO_7A) P1.A19(IO_7A) P1.A22(IO_7A) P1.B5(IO_8A) P1.E7(IO_8A) P1.E20(IO_7A) P1.G16(IO_7A) P1.G20(IO_7A) P1.H10(IO_7A) P1.H20(IO_7A) P1.K19(IO_7A) P1.K20(IO_7A)
SI_INT#: P1.J19(IO_7A) R60.2
T_CA_0: P1.L7(IO_8A)
T_CA_1: P1.K7(IO_8A)
T_CA_2: P1.H8(IO_8A)
T_CA_3: P1.G8(IO_8A)
T_CA_4: P1.J7(IO_8A)
T_CA_5: P1.J8(IO_8A)
T_CA_6: P1.A10(IO_8A)
T_CA_7: P1.A9(IO_8A)
T_CA_8: P1.A8(IO_8A)
T_CA_9: P1.A7(IO_8A)
T_CK: P1.J9(IO_8A)
T_CK#: P1.H9(IO_8A)
T_CKE_0: P1.F14(IO_7A)
T_CS#_0: P1.E9(IO_8A)
T_DM_0: P1.G11(IO_7A)
T_DM_1: P1.J17(IO_7A)
T_DM_2: P1.B16(IO_7A)
T_DM_3: P1.E22(IO_7A)
T_DQ_0: P1.E12(IO_7A)
T_DQ_1: P1.D12(IO_7A)
T_DQ_2: P1.C11(IO_7A)
T_DQ_3: P1.K9(IO_7A)
T_DQ_4: P1.C13(IO_7A)
T_DQ_5: P1.D13(IO_7A)
T_DQ_6: P1.B12(IO_7A)
T_DQ_7: P1.F12(IO_7A)
T_DQ_8: P1.F13(IO_7A)
T_DQ_9: P1.E14(IO_7A)
T_DQ_10: P1.J11(IO_7A)
T_DQ_11: P1.A13(IO_7A)
T_DQ_12: P1.B15(IO_7A)
T_DQ_13: P1.C15(IO_7A)
T_DQ_14: P1.G15(IO_7A)
T_DQ_15: P1.K16(IO_7A)
T_DQ_16: P1.F15(IO_7A)
T_DQ_17: P1.E15(IO_7A)
T_DQ_18: P1.A15(IO_7A)
T_DQ_19: P1.J18(IO_7A)
T_DQ_20: P1.E16(IO_7A)
T_DQ_21: P1.D17(IO_7A)
T_DQ_22: P1.G17(IO_7A)
T_DQ_23: P1.C16(IO_7A)
T_DQ_24: P1.A17(IO_7A)
T_DQ_25: P1.A18(IO_7A)
T_DQ_26: P1.A20(IO_7A)
T_DQ_27: P1.F20(IO_7A)
T_DQ_28: P1.C18(IO_7A)
T_DQ_29: P1.C19(IO_7A)
T_DQ_30: P1.B22(IO_7A)
T_DQ_31: P1.D22(IO_7A)
T_DQS#_0: P1.G12(IO_7A)
T_DQS#_1: P1.J13(IO_7A)
T_DQS#_2: P1.H18(IO_7A)
T_DQS#_3: P1.F18(IO_7A)
T_DQS_0: P1.H11(IO_7A)
T_DQS_1: P1.H14(IO_7A)
T_DQS_2: P1.G18(IO_7A)
T_DQS_3: P1.F19(IO_7A)

## Notes on the sheet
- VCCIO = 1.2V
- VCCIO = 1.2V

# Schematic fpga4
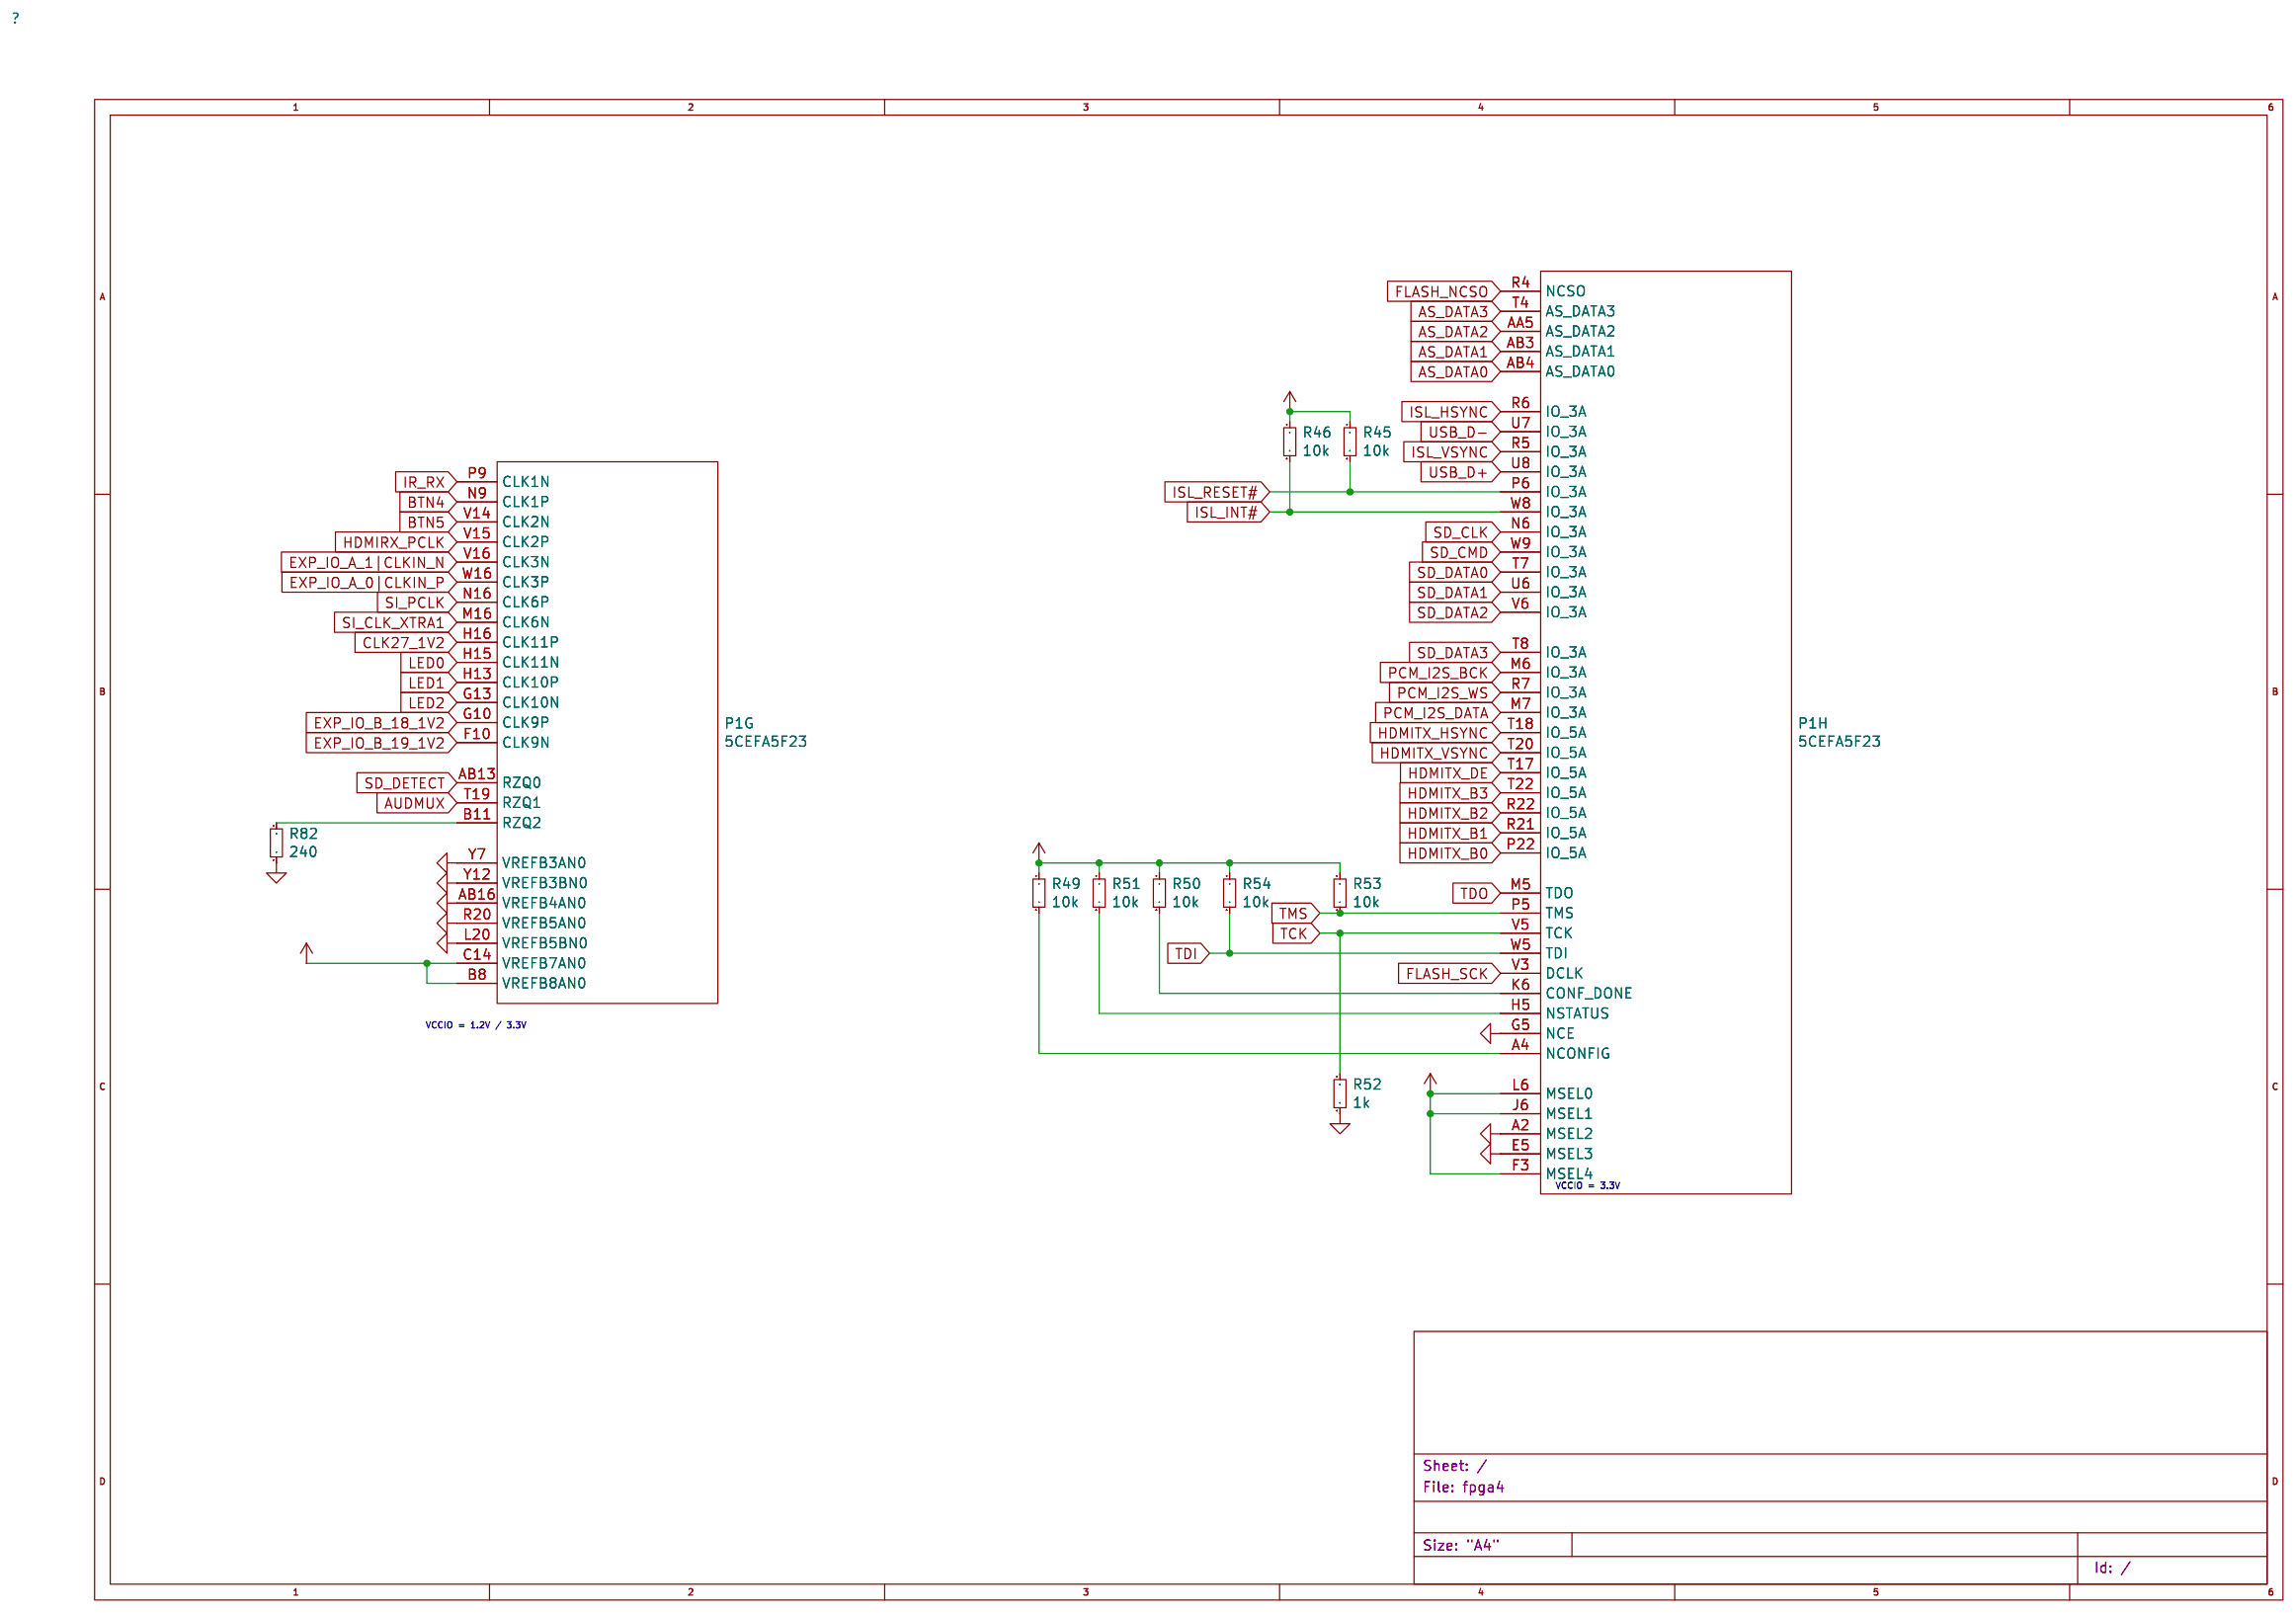
[diagram p7: schematic sheet]

## Parts
P1  5CEFA5F23  (sections 7,8)
R45  10k
R46  10k
R49  10k
R50  10k
R51  10k
R52  1k
R53  10k
R54  10k
R82  240

## Library data of the parts
P1 = custom_components_5CEFA5F23
R45 R46 R49-R54 R82 = Device_R_Small

## Nets
AS_DATA0: P1.AB4(AS_DATA0)
AS_DATA1: P1.AB3(AS_DATA1)
AS_DATA2: P1.AA5(AS_DATA2)
AS_DATA3: P1.T4(AS_DATA3)
AUDMUX: P1.T19(RZQ1)
BTN4: P1.N9(CLK1P)
BTN5: P1.V14(CLK2N)
CLK27_1V2: P1.H16(CLK11P)
CUSTOM_COMPONENTS_DVDD3V3: P1.F3(MSEL4) P1.J6(MSEL1) P1.L6(MSEL0) R45.1 R46.1 R49.1 R50.1 R51.1 R53.1 R54.1
CUSTOM_COMPONENTS_VREFDQ_LPDDR2: P1.B8(VREFB8AN0) P1.C14(VREFB7AN0)
EXP_IO_A_0|CLKIN_P: P1.W16(CLK3P)
EXP_IO_A_1|CLKIN_N: P1.V16(CLK3N)
EXP_IO_B_18_1V2: P1.G10(CLK9P)
EXP_IO_B_19_1V2: P1.F10(CLK9N)
FLASH_NCSO: P1.R4(NCSO)
FLASH_SCK: P1.V3(DCLK)
HDMIRX_PCLK: P1.V15(CLK2P)
HDMITX_B0: P1.P22(IO_5A)
HDMITX_B1: P1.R21(IO_5A)
HDMITX_B2: P1.R22(IO_5A)
HDMITX_B3: P1.T22(IO_5A)
HDMITX_DE: P1.T17(IO_5A)
HDMITX_HSYNC: P1.T18(IO_5A)
HDMITX_VSYNC: P1.T20(IO_5A)
IR_RX: P1.P9(CLK1N)
ISL_HSYNC: P1.R6(IO_3A)
ISL_INT#: P1.W8(IO_3A) R46.2
ISL_RESET#: P1.P6(IO_3A) R45.2
ISL_VSYNC: P1.R5(IO_3A)
LED0: P1.H15(CLK11N)
LED1: P1.H13(CLK10P)
LED2: P1.G13(CLK10N)
PCM_I2S_BCK: P1.M6(IO_3A)
PCM_I2S_DATA: P1.M7(IO_3A)
PCM_I2S_WS: P1.R7(IO_3A)
POWER_GND: P1.A2(MSEL2) P1.AB16(VREFB4AN0) P1.E5(MSEL3) P1.G5(NCE) P1.L20(VREFB5BN0) P1.R20(VREFB5AN0) P1.Y7(VREFB3AN0) P1.Y12(VREFB3BN0) R52.2 R82.2
SD_CLK: P1.N6(IO_3A)
SD_CMD: P1.W9(IO_3A)
SD_DATA0: P1.T7(IO_3A)
SD_DATA1: P1.U6(IO_3A)
SD_DATA2: P1.V6(IO_3A)
SD_DATA3: P1.T8(IO_3A)
SD_DETECT: P1.AB13(RZQ0)
SI_CLK_XTRA1: P1.M16(CLK6N)
SI_PCLK: P1.N16(CLK6P)
TCK: P1.V5(TCK) R52.1
TDI: P1.W5(TDI) R54.2
TDO: P1.M5(TDO)
TMS: P1.P5(TMS) R53.2
USB_D+: P1.U8(IO_3A)
USB_D-: P1.U7(IO_3A)
Net-(P1-A4): P1.A4(NCONFIG) R49.2
Net-(P1-B11): P1.B11(RZQ2) R82.1
Net-(P1-H5): P1.H5(NSTATUS) R51.2
Net-(P1-K6): P1.K6(CONF_DONE) R50.2

## Notes on the sheet
- VCCIO = 1.2V / 3.3V
- VCCIO = 3.3V

# Schematic fpga5
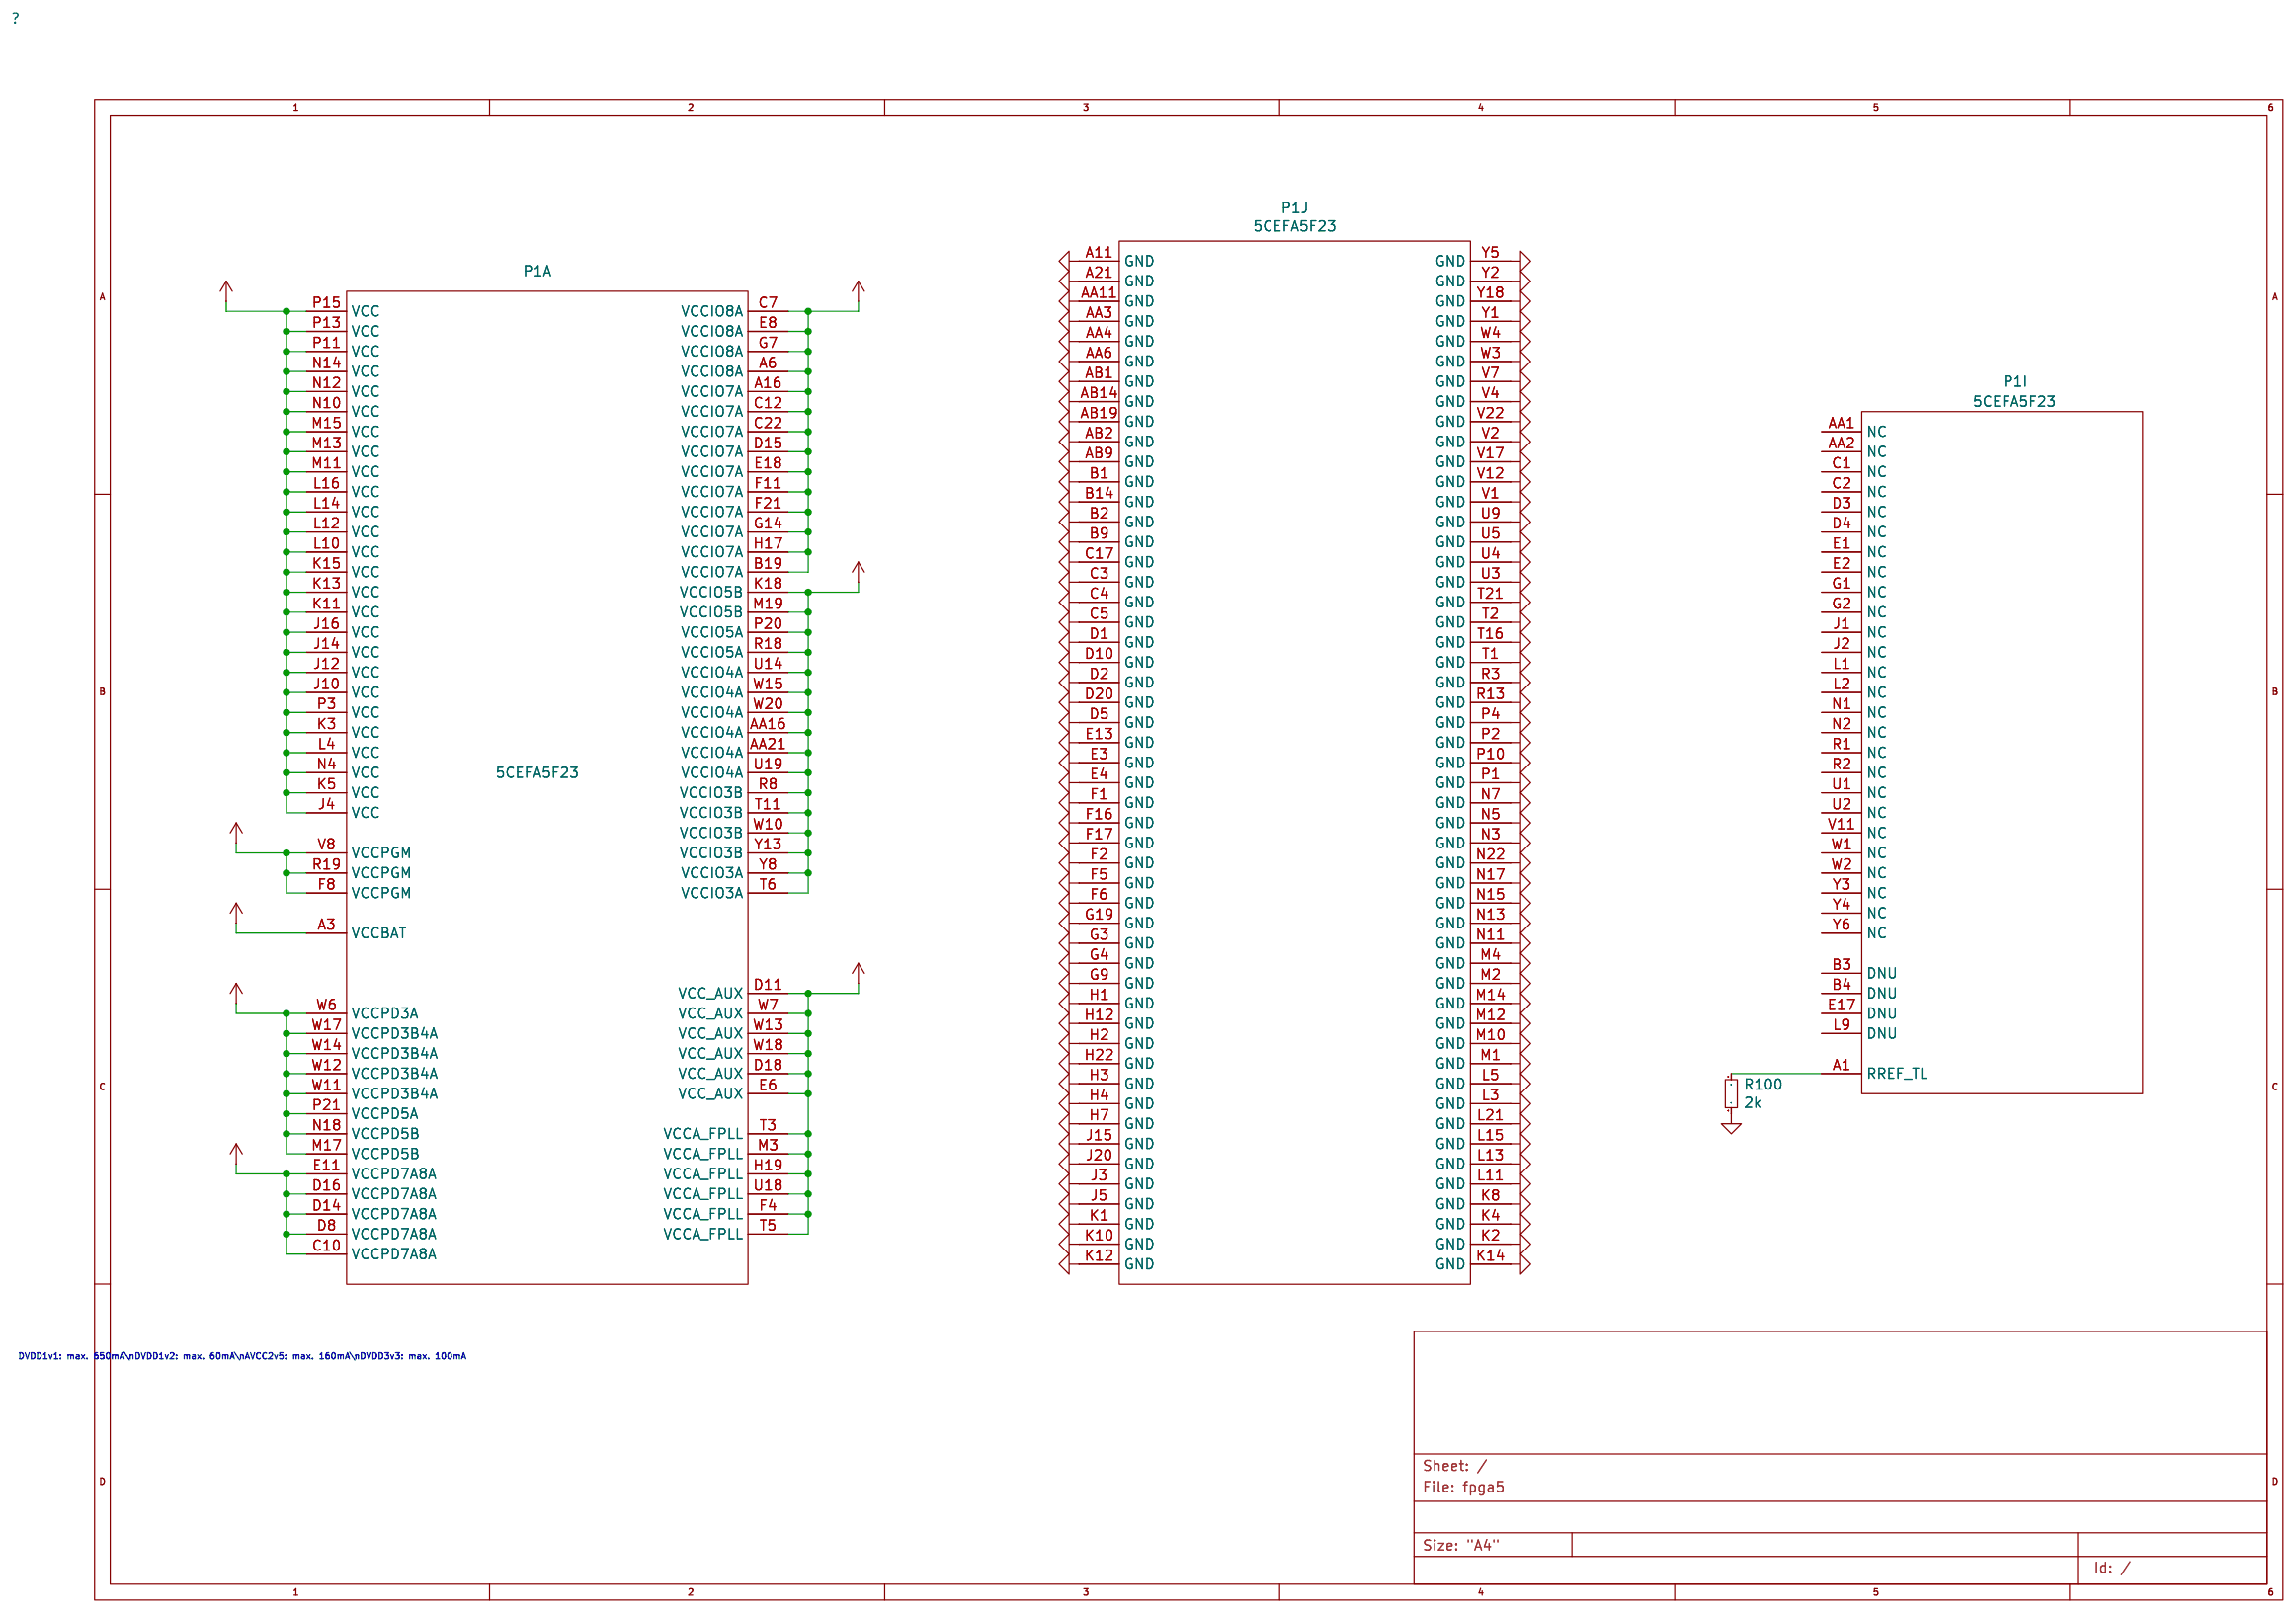
[diagram p8: schematic sheet]

## Parts
P1  5CEFA5F23  (sections 1,10,9)
R100  2k

## Library data of the parts
P1 = custom_components_5CEFA5F23
R100 = Device_R_Small

## Nets
CUSTOM_COMPONENTS_AVCC2V5: P1.A3(VCCBAT) P1.D11(VCC_AUX) P1.D18(VCC_AUX) P1.E6(VCC_AUX) P1.F4(VCCA_FPLL) P1.H19(VCCA_FPLL) P1.M3(VCCA_FPLL) P1.T3(VCCA_FPLL) P1.T5(VCCA_FPLL) P1.U18(VCCA_FPLL) P1.W7(VCC_AUX) P1.W13(VCC_AUX) P1.W18(VCC_AUX)
CUSTOM_COMPONENTS_DVDD1V1: P1.J4(VCC) P1.J10(VCC) P1.J12(VCC) P1.J14(VCC) P1.J16(VCC) P1.K3(VCC) P1.K5(VCC) P1.K11(VCC) P1.K13(VCC) P1.K15(VCC) P1.L4(VCC) P1.L10(VCC) P1.L12(VCC) P1.L14(VCC) P1.L16(VCC) P1.M11(VCC) P1.M13(VCC) P1.M15(VCC) P1.N4(VCC) P1.N10(VCC) P1.N12(VCC) P1.N14(VCC) P1.P3(VCC) P1.P11(VCC) P1.P13(VCC) P1.P15(VCC)
CUSTOM_COMPONENTS_DVDD1V2: P1.A6(VCCIO8A) P1.A16(VCCIO7A) P1.B19(VCCIO7A) P1.C7(VCCIO8A) P1.C12(VCCIO7A) P1.C22(VCCIO7A) P1.D15(VCCIO7A) P1.E8(VCCIO8A) P1.E18(VCCIO7A) P1.F11(VCCIO7A) P1.F21(VCCIO7A) P1.G7(VCCIO8A) P1.G14(VCCIO7A) P1.H17(VCCIO7A)
CUSTOM_COMPONENTS_DVDD2V5: P1.C10(VCCPD7A8A) P1.D8(VCCPD7A8A) P1.D14(VCCPD7A8A) P1.D16(VCCPD7A8A) P1.E11(VCCPD7A8A)
CUSTOM_COMPONENTS_DVDD3V3: P1.AA16(VCCIO4A) P1.AA21(VCCIO4A) P1.F8(VCCPGM) P1.K18(VCCIO5B) P1.M17(VCCPD5B) P1.M19(VCCIO5B) P1.N18(VCCPD5B) P1.P20(VCCIO5A) P1.P21(VCCPD5A) P1.R8(VCCIO3B) P1.R18(VCCIO5A) P1.R19(VCCPGM) P1.T6(VCCIO3A) P1.T11(VCCIO3B) P1.U14(VCCIO4A) P1.U19(VCCIO4A) P1.V8(VCCPGM) P1.W6(VCCPD3A) P1.W10(VCCIO3B) P1.W11(VCCPD3B4A) P1.W12(VCCPD3B4A) P1.W14(VCCPD3B4A) P1.W15(VCCIO4A) P1.W17(VCCPD3B4A) P1.W20(VCCIO4A) P1.Y8(VCCIO3A) P1.Y13(VCCIO3B)
POWER_GND: P1.A11(GND) P1.A21(GND) P1.AA3(GND) P1.AA4(GND) P1.AA6(GND) P1.AA11(GND) P1.AB1(GND) P1.AB2(GND) P1.AB9(GND) P1.AB14(GND) P1.AB19(GND) P1.B1(GND) P1.B2(GND) P1.B9(GND) P1.B14(GND) P1.C3(GND) P1.C4(GND) P1.C5(GND) P1.C17(GND) P1.D1(GND) P1.D2(GND) P1.D5(GND) P1.D10(GND) P1.D20(GND) P1.E3(GND) P1.E4(GND) P1.E13(GND) P1.F1(GND) P1.F2(GND) P1.F5(GND) P1.F6(GND) P1.F16(GND) P1.F17(GND) P1.G3(GND) P1.G4(GND) P1.G9(GND) P1.G19(GND) P1.H1(GND) P1.H2(GND) P1.H3(GND) P1.H4(GND) P1.H7(GND) P1.H12(GND) P1.H22(GND) P1.J3(GND) P1.J5(GND) P1.J15(GND) P1.J20(GND) P1.K1(GND) P1.K2(GND) P1.K4(GND) P1.K8(GND) P1.K10(GND) P1.K12(GND) P1.K14(GND) P1.L3(GND) P1.L5(GND) P1.L11(GND) P1.L13(GND) P1.L15(GND) P1.L21(GND) P1.M1(GND) P1.M2(GND) P1.M4(GND) P1.M10(GND) P1.M12(GND) P1.M14(GND) P1.N3(GND) P1.N5(GND) P1.N7(GND) P1.N11(GND) P1.N13(GND) P1.N15(GND) P1.N17(GND) P1.N22(GND) P1.P1(GND) P1.P2(GND) P1.P4(GND) P1.P10(GND) P1.R3(GND) P1.R13(GND) P1.T1(GND) P1.T2(GND) P1.T16(GND) P1.T21(GND) P1.U3(GND) P1.U4(GND) P1.U5(GND) P1.U9(GND) P1.V1(GND) P1.V2(GND) P1.V4(GND) P1.V7(GND) P1.V12(GND) P1.V17(GND) P1.V22(GND) P1.W3(GND) P1.W4(GND) P1.Y1(GND) P1.Y2(GND) P1.Y5(GND) P1.Y18(GND) R100.2
Net-(P1-A1): P1.A1(RREF_TL) R100.1

Not connected (* = marked no-connect by the designer): P1 AA1(NC) AA2(NC) B3(DNU) B4(DNU) C1(NC) C2(NC) D3(NC) D4(NC) E1(NC) E2(NC) E17(DNU) G1(NC) G2(NC) J1(NC) J2(NC) L1(NC) L2(NC) L9(DNU) N1(NC) N2(NC) R1(NC) R2(NC) U1(NC) U2(NC) V11(NC) W1(NC) W2(NC) Y3(NC) Y4(NC) Y6(NC)

## Notes on the sheet
- DVDD1v1: max. 650mA\nDVDD1v2: max. 60mA\nAVCC2v5: max. 160mA\nDVDD3v3: max. 100mA

# Schematic fpga6
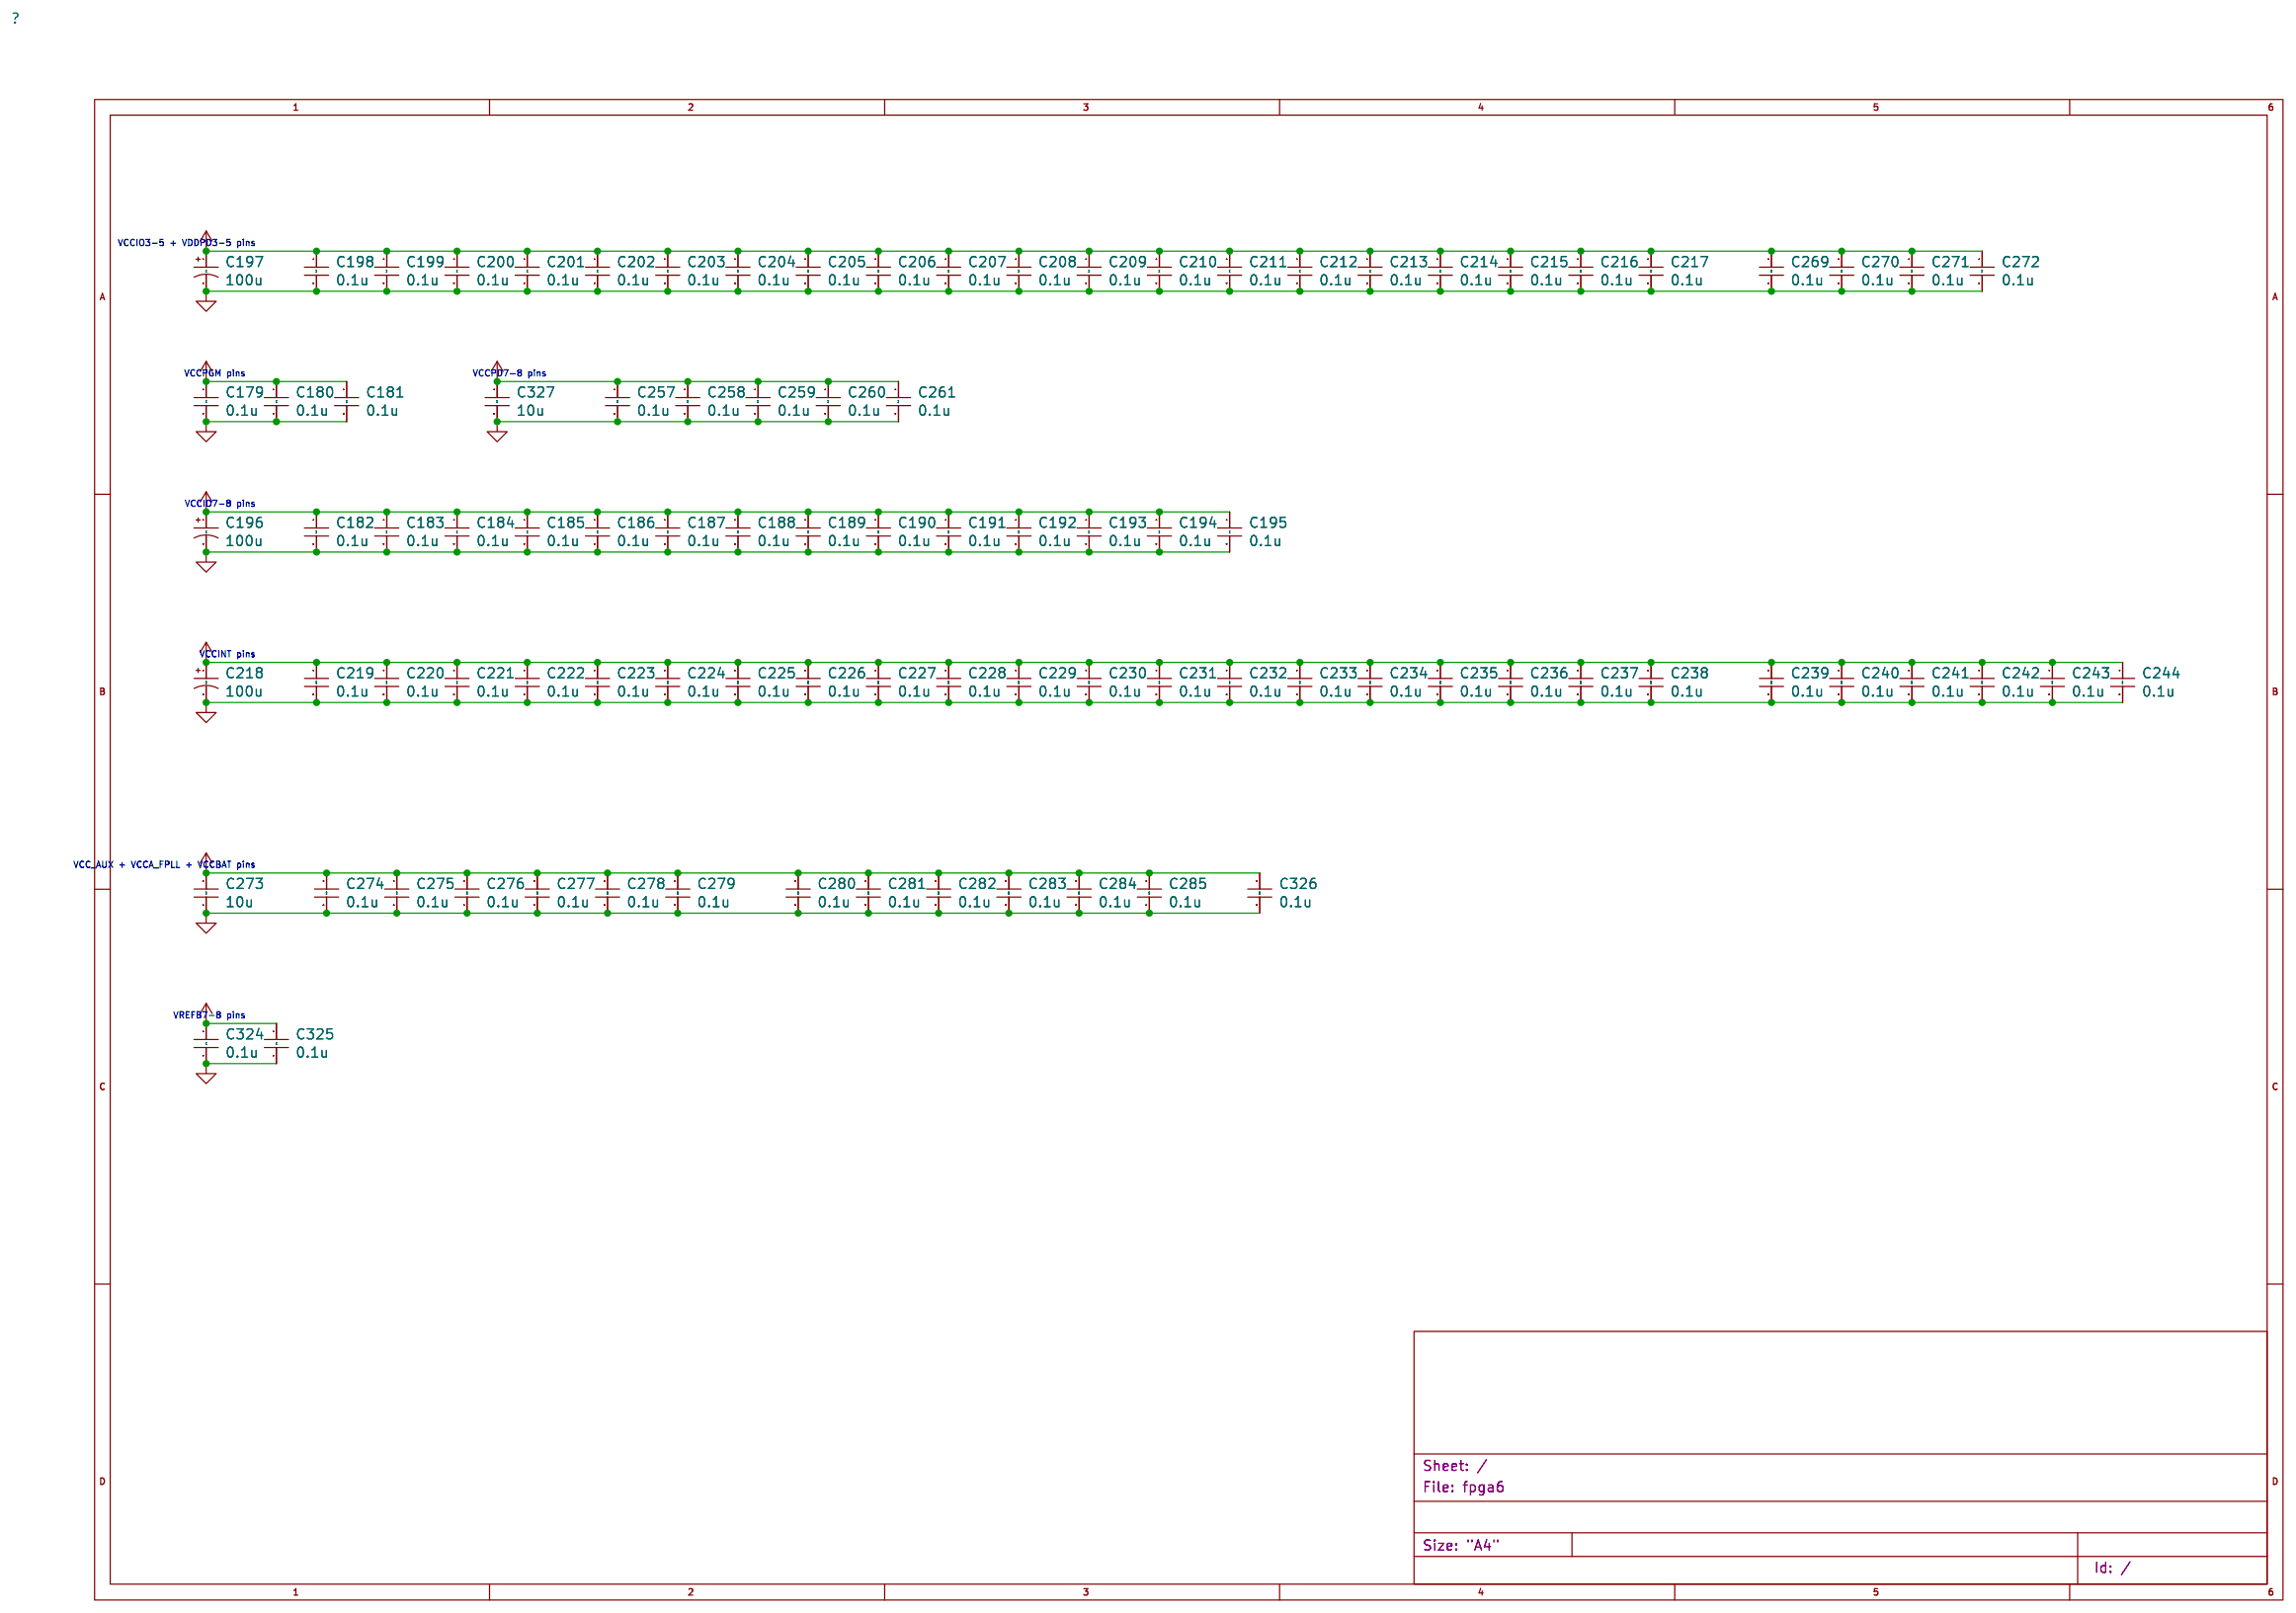
[diagram p9: schematic sheet]

## Parts
C179  0.1u
C180  0.1u
C181  0.1u
C182  0.1u
C183  0.1u
C184  0.1u
C185  0.1u
C186  0.1u
C187  0.1u
C188  0.1u
C189  0.1u
C190  0.1u
C191  0.1u
C192  0.1u
C193  0.1u
C194  0.1u
C195  0.1u
C196  100u
C197  100u
C198  0.1u
C199  0.1u
C200  0.1u
C201  0.1u
C202  0.1u
C203  0.1u
C204  0.1u
C205  0.1u
C206  0.1u
C207  0.1u
C208  0.1u
C209  0.1u
C210  0.1u
C211  0.1u
C212  0.1u
C213  0.1u
C214  0.1u
C215  0.1u
C216  0.1u
C217  0.1u
C218  100u  [Capacitor_SMD:CP_Elec_6.3x5.4]
C219  0.1u
C220  0.1u
C221  0.1u
C222  0.1u
C223  0.1u
C224  0.1u
C225  0.1u
C226  0.1u
C227  0.1u
C228  0.1u
C229  0.1u
C230  0.1u
C231  0.1u
C232  0.1u
C233  0.1u
C234  0.1u
C235  0.1u
C236  0.1u
C237  0.1u
C238  0.1u
C239  0.1u
C240  0.1u
C241  0.1u
C242  0.1u
C243  0.1u
C244  0.1u
C257  0.1u
C258  0.1u
C259  0.1u
C260  0.1u
C261  0.1u
C269  0.1u
C270  0.1u
C271  0.1u
C272  0.1u
C273  10u
C274  0.1u
C275  0.1u
C276  0.1u
C277  0.1u
C278  0.1u
C279  0.1u
C280  0.1u
C281  0.1u
C282  0.1u
C283  0.1u
C284  0.1u
C285  0.1u
C324  0.1u
C325  0.1u
C326  0.1u
C327  10u

## Library data of the parts
C179-C195 C198-C217 C219-C244 C257-C261 C269-C285 C324-C327 = Device_C_Small
C196 C197 = Device_CP1_Small
C218 = Device_CP1_Small_1

## Nets
CUSTOM_COMPONENTS_DVDD1V2: C182.1 C183.1 C184.1 C185.1 C186.1 C187.1 C188.1 C189.1 C190.1 C191.1 C192.1 C193.1 C194.1 C195.1 C196.1
CUSTOM_COMPONENTS_DVDD2V5: C257.1 C258.1 C259.1 C260.1 C261.1 C273.1 C274.1 C275.1 C276.1 C277.1 C278.1 C279.1 C280.1 C281.1 C282.1 C283.1 C284.1 C285.1 C326.1 C327.1
CUSTOM_COMPONENTS_DVDD3V3: C179.1 C180.1 C181.1 C197.1 C198.1 C199.1 C200.1 C201.1 C202.1 C203.1 C204.1 C205.1 C206.1 C207.1 C208.1 C209.1 C210.1 C211.1 C212.1 C213.1 C214.1 C215.1 C216.1 C217.1 C218.1 C219.1 C220.1 C221.1 C222.1 C223.1 C224.1 C225.1 C226.1 C227.1 C228.1 C229.1 C230.1 C231.1 C232.1 C233.1 C234.1 C235.1 C236.1 C237.1 C238.1 C239.1 C240.1 C241.1 C242.1 C243.1 C244.1 C269.1 C270.1 C271.1 C272.1
CUSTOM_COMPONENTS_VREFDQ_LPDDR2: C324.1 C325.1
POWER_GND: C179.2 C180.2 C181.2 C182.2 C183.2 C184.2 C185.2 C186.2 C187.2 C188.2 C189.2 C190.2 C191.2 C192.2 C193.2 C194.2 C195.2 C196.2 C197.2 C198.2 C199.2 C200.2 C201.2 C202.2 C203.2 C204.2 C205.2 C206.2 C207.2 C208.2 C209.2 C210.2 C211.2 C212.2 C213.2 C214.2 C215.2 C216.2 C217.2 C218.2 C219.2 C220.2 C221.2 C222.2 C223.2 C224.2 C225.2 C226.2 C227.2 C228.2 C229.2 C230.2 C231.2 C232.2 C233.2 C234.2 C235.2 C236.2 C237.2 C238.2 C239.2 C240.2 C241.2 C242.2 C243.2 C244.2 C257.2 C258.2 C259.2 C260.2 C261.2 C269.2 C270.2 C271.2 C272.2 C273.2 C274.2 C275.2 C276.2 C277.2 C278.2 C279.2 C280.2 C281.2 C282.2 C283.2 C284.2 C285.2 C324.2 C325.2 C326.2 C327.2

## Notes on the sheet
- VCCIO3-5 + VDDPD3-5 pins
- VCCPGM pins
- VCCPD7-8 pins
- VCCIO7-8 pins
- VCCINT pins
- VCC_AUX + VCCA_FPLL + VCCBAT pins
- VREFB7-8 pins

# Schematic hdmi
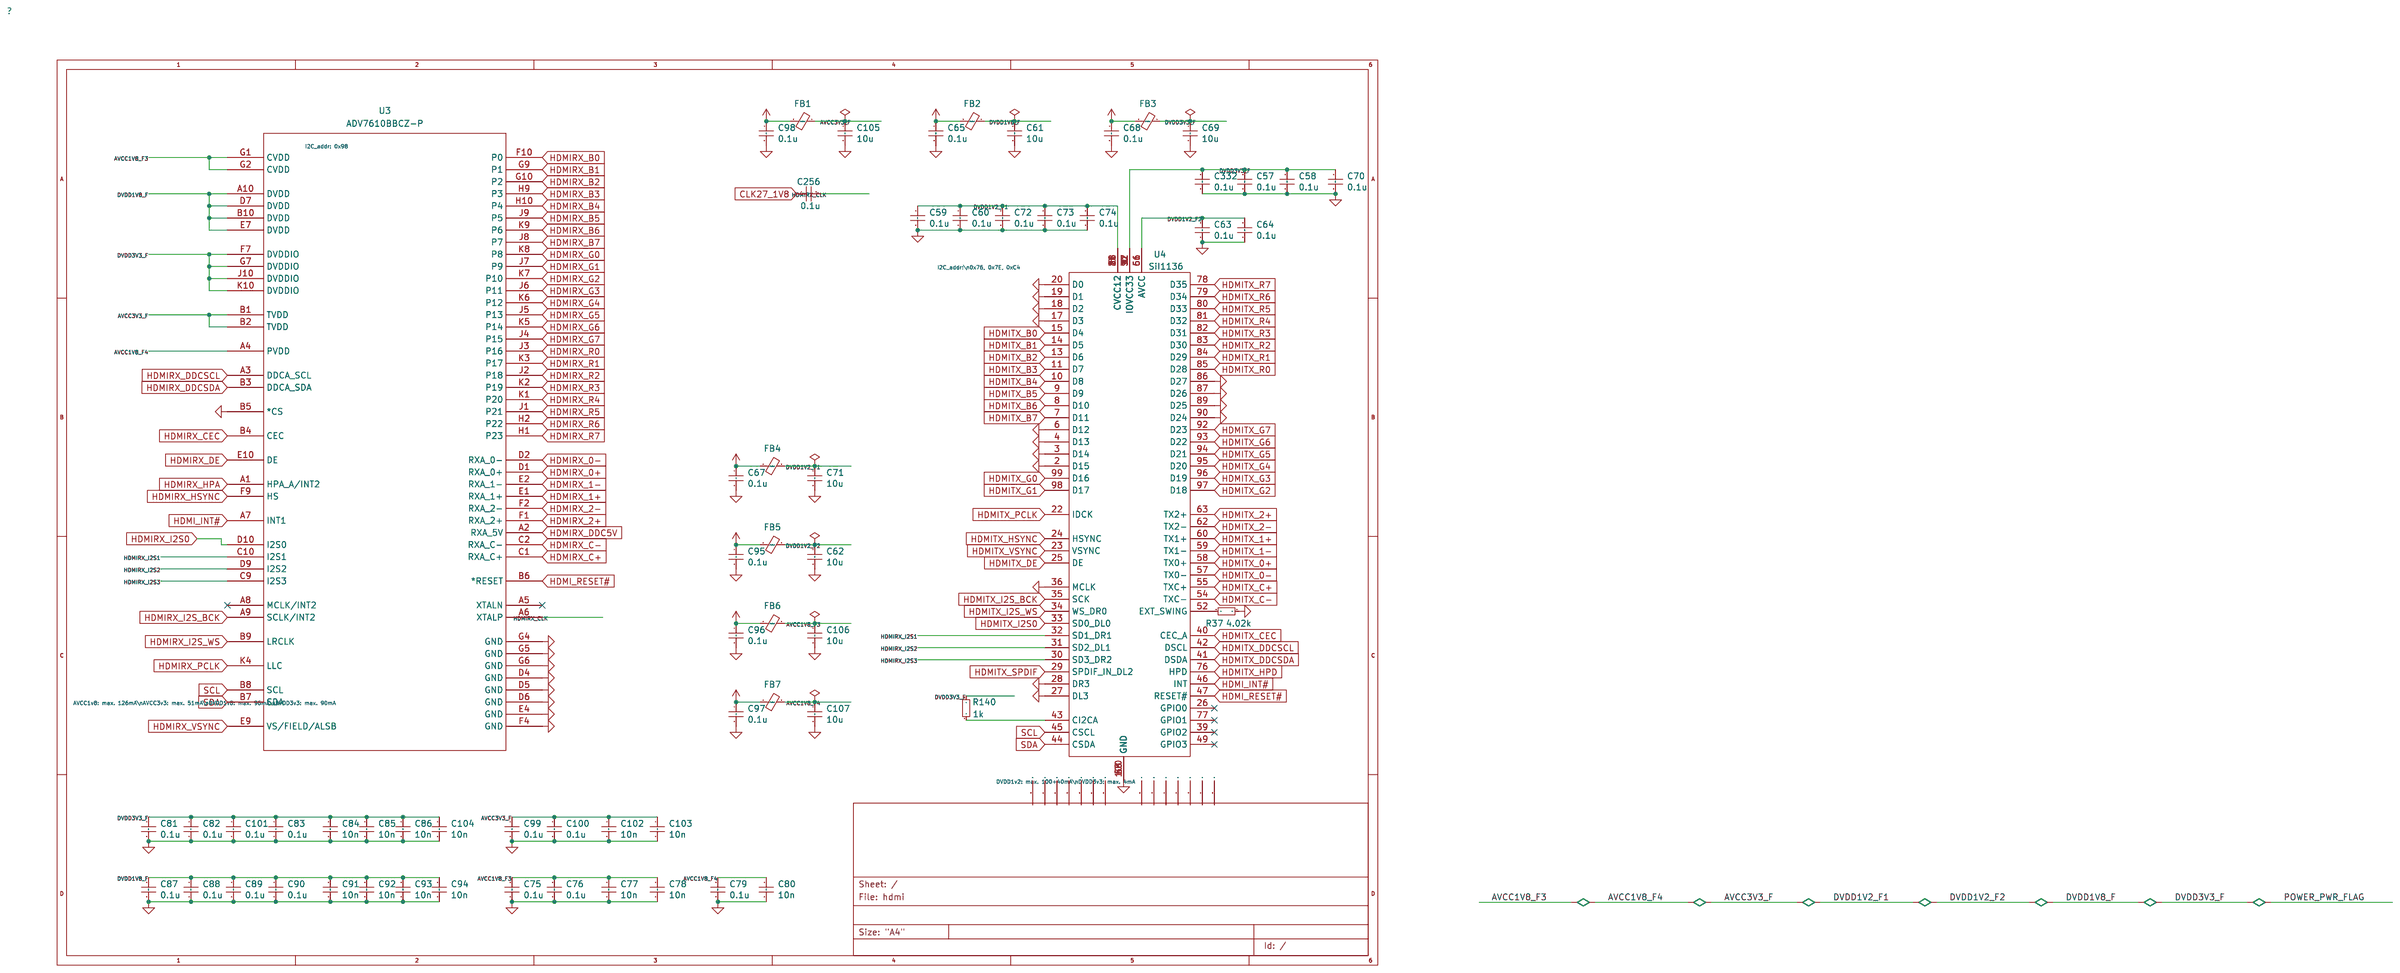
[diagram p10: schematic sheet]

## Parts
C57  0.1u
C58  0.1u
C59  0.1u
C60  0.1u
C61  10u
C62  10u
C63  0.1u
C64  0.1u
C65  0.1u
C67  0.1u
C68  0.1u
C69  10u
C70  0.1u
C71  10u
C72  0.1u
C73  0.1u
C74  0.1u
C75  0.1u
C76  0.1u
C77  10n
C78  10n
C79  0.1u
C80  10n
C81  0.1u
C82  0.1u
C83  0.1u
C84  10n
C85  10n
C86  10n
C87  0.1u
C88  0.1u
C89  0.1u
C90  0.1u
C91  10n
C92  10n
C93  10n
C94  10n
C95  0.1u
C96  0.1u
C97  0.1u
C98  0.1u
C99  0.1u
C100  0.1u
C101  0.1u
C102  10n
C103  10n
C104  10n
C105  10u
C106  10u
C107  10u
C256  0.1u
C332  0.1u
FB1  MPZ1608R391ATA00
FB2  MPZ1608R391ATA00
FB3  MPZ1608R391ATA00  [Inductor_SMD:L_0603_1608Metric]
FB4  MPZ1608R391ATA00
FB5  MPZ1608R391ATA00
FB6  MPZ1608R391ATA00
FB7  MPZ1608R391ATA00
R37  4.02k
R140  1k
U3  ADV7610BBCZ-P  [custom_components:ADV7610BBCZ]
U4  SiI1136  [custom_components:TQFP-100_thermal]

## Library data of the parts
C57-C65 C67-C107 C256 C332 = Device_C_Small
FB1 FB2 FB4-FB7 = Device_Ferrite_Bead_Small
FB3 = Device_Ferrite_Bead_Small_1
R37 R140 = Device_R_Small
U3 = custom_components_ADV7610BBCZ
U4 = custom_components_SiI1136

## Nets
CLK27_1V8: C256.1
CUSTOM_COMPONENTS_AVCC1V8: C96.1 C97.1 FB6.2 FB7.2
CUSTOM_COMPONENTS_AVCC3V3: C98.1 FB1.2
CUSTOM_COMPONENTS_DVDD1V2: C67.1 C95.1 FB4.2 FB5.2
CUSTOM_COMPONENTS_DVDD1V8: C65.1 FB2.2
CUSTOM_COMPONENTS_DVDD3V3: C68.1 FB3.2
HDMI_INT#: U3.A7(INT1) U4.46(INT)
HDMI_RESET#: U3.B6(*RESET) U4.47(RESET#)
HDMIRX_0+: U3.D1(RXA_0+)
HDMIRX_0-: U3.D2(RXA_0-)
HDMIRX_1+: U3.E1(RXA_1+)
HDMIRX_1-: U3.E2(RXA_1-)
HDMIRX_2+: U3.F1(RXA_2+)
HDMIRX_2-: U3.F2(RXA_2-)
HDMIRX_B0: U3.F10(P0)
HDMIRX_B1: U3.G9(P1)
HDMIRX_B2: U3.G10(P2)
HDMIRX_B3: U3.H9(P3)
HDMIRX_B4: U3.H10(P4)
HDMIRX_B5: U3.J9(P5)
HDMIRX_B6: U3.K9(P6)
HDMIRX_B7: U3.J8(P7)
HDMIRX_C+: U3.C1(RXA_C+)
HDMIRX_C-: U3.C2(RXA_C-)
HDMIRX_CEC: U3.B4(CEC)
HDMIRX_CLK: C256.2 U3.A6(XTALP)
HDMIRX_DDC5V: U3.A2(RXA_5V)
HDMIRX_DDCSCL: U3.A3(DDCA_SCL)
HDMIRX_DDCSDA: U3.B3(DDCA_SDA)
HDMIRX_DE: U3.E10(DE)
HDMIRX_G0: U3.K8(P8)
HDMIRX_G1: U3.J7(P9)
HDMIRX_G2: U3.K7(P10)
HDMIRX_G3: U3.J6(P11)
HDMIRX_G4: U3.K6(P12)
HDMIRX_G5: U3.J5(P13)
HDMIRX_G6: U3.K5(P14)
HDMIRX_G7: U3.J4(P15)
HDMIRX_HPA: U3.A1(HPA_A/INT2)
HDMIRX_HSYNC: U3.F9(HS)
HDMIRX_I2S0: U3.D10(I2S0)
HDMIRX_I2S1: U3.C10(I2S1) U4.32(SD1_DR1)
HDMIRX_I2S2: U3.D9(I2S2) U4.31(SD2_DL1)
HDMIRX_I2S3: U3.C9(I2S3) U4.30(SD3_DR2)
HDMIRX_I2S_BCK: U3.A9(SCLK/INT2)
HDMIRX_I2S_WS: U3.B9(LRCLK)
HDMIRX_PCLK: U3.K4(LLC)
HDMIRX_R0: U3.J3(P16)
HDMIRX_R1: U3.K3(P17)
HDMIRX_R2: U3.J2(P18)
HDMIRX_R3: U3.K2(P19)
HDMIRX_R4: U3.K1(P20)
HDMIRX_R5: U3.J1(P21)
HDMIRX_R6: U3.H2(P22)
HDMIRX_R7: U3.H1(P23)
HDMIRX_VSYNC: U3.E9(VS/FIELD/ALSB)
HDMITX_0+: U4.58(TX0+)
HDMITX_0-: U4.57(TX0-)
HDMITX_1+: U4.60(TX1+)
HDMITX_1-: U4.59(TX1-)
HDMITX_2+: U4.63(TX2+)
HDMITX_2-: U4.62(TX2-)
HDMITX_B0: U4.15(D4)
HDMITX_B1: U4.14(D5)
HDMITX_B2: U4.13(D6)
HDMITX_B3: U4.11(D7)
HDMITX_B4: U4.10(D8)
HDMITX_B5: U4.9(D9)
HDMITX_B6: U4.8(D10)
HDMITX_B7: U4.7(D11)
HDMITX_C+: U4.55(TXC+)
HDMITX_C-: U4.54(TXC-)
HDMITX_CEC: U4.40(CEC_A)
HDMITX_DDCSCL: U4.42(DSCL)
HDMITX_DDCSDA: U4.41(DSDA)
HDMITX_DE: U4.25(DE)
HDMITX_G0: U4.99(D16)
HDMITX_G1: U4.98(D17)
HDMITX_G2: U4.97(D18)
HDMITX_G3: U4.96(D19)
HDMITX_G4: U4.95(D20)
HDMITX_G5: U4.94(D21)
HDMITX_G6: U4.93(D22)
HDMITX_G7: U4.92(D23)
HDMITX_HPD: U4.76(HPD)
HDMITX_HSYNC: U4.24(HSYNC)
HDMITX_I2S0: U4.33(SD0_DL0)
HDMITX_I2S_BCK: U4.35(SCK)
HDMITX_I2S_WS: U4.34(WS_DR0)
HDMITX_PCLK: U4.22(IDCK)
HDMITX_R0: U4.85(D28)
HDMITX_R1: U4.84(D29)
HDMITX_R2: U4.83(D30)
HDMITX_R3: U4.82(D31)
HDMITX_R4: U4.81(D32)
HDMITX_R5: U4.80(D33)
HDMITX_R6: U4.79(D34)
HDMITX_R7: U4.78(D35)
HDMITX_SPDIF: U4.29(SPDIF_IN_DL2)
HDMITX_VSYNC: U4.23(VSYNC)
POWER_GND: C57.2 C58.2 C59.2 C60.2 C61.2 C62.2 C63.2 C64.2 C65.2 C67.2 C68.2 C69.2 C70.2 C71.2 C72.2 C73.2 C74.2 C75.2 C76.2 C77.2 C78.2 C79.2 C80.2 C81.2 C82.2 C83.2 C84.2 C85.2 C86.2 C87.2 C88.2 C89.2 C90.2 C91.2 C92.2 C93.2 C94.2 C95.2 C96.2 C97.2 C98.2 C99.2 C100.2 C101.2 C102.2 C103.2 C104.2 C105.2 C106.2 C107.2 C332.2 R37.1 U3.B5(*CS) U3.D4(GND) U3.D5(GND) U3.D6(GND) U3.E4(GND) U3.F4(GND) U3.G4(GND) U3.G5(GND) U3.G6(GND) U4.2(D15) U4.3(D14) U4.4(D13) U4.6(D12) U4.17(D3) U4.18(D2) U4.19(D1) U4.20(D0) U4.27(DL3) U4.28(DR3) U4.36(MCLK) U4.48(GND) U4.53(GND) U4.86(D27) U4.87(D26) U4.89(D25) U4.90(D24) U4.100(GND) U4.EP(GND)
POWER_PWR_FLAG: C57.1 C58.1 C59.1 C60.1 C61.1 C62.1 C63.1 C64.1 C69.1 C70.1 C71.1 C72.1 C73.1 C74.1 C75.1 C76.1 C77.1 C78.1 C79.1 C80.1 C81.1 C82.1 C83.1 C84.1 C85.1 C86.1 C87.1 C88.1 C89.1 C90.1 C91.1 C92.1 C93.1 C94.1 C99.1 C100.1 C101.1 C102.1 C103.1 C104.1 C105.1 C106.1 C107.1 C332.1 FB1.1 FB2.1 FB3.1 FB4.1 FB5.1 FB6.1 FB7.1 R140.2 U3.A4(PVDD) U3.A10(DVDD) U3.B1(TVDD) U3.B2(TVDD) U3.B10(DVDD) U3.D7(DVDD) U3.E7(DVDD) U3.F7(DVDDIO) U3.G1(CVDD) U3.G2(CVDD) U3.G7(DVDDIO) U3.J10(DVDDIO) U3.K10(DVDDIO) U4.1(IOVCC33) U4.5(CVCC12) U4.12(IOVCC33) U4.16(CVCC12) U4.21(CVCC12) U4.37(IOVCC33) U4.38(CVCC12) U4.56(AVCC) U4.61(AVCC) U4.88(CVCC12) U4.91(IOVCC33)
SCL: U3.B8(SCL) U4.45(CSCL)
SDA: U3.B7(SDA) U4.44(CSDA)
Net-(R37-2): R37.2 U4.52(EXT_SWING)
Net-(R140-1): R140.1 U4.43(CI2CA)

Not connected (* = marked no-connect by the designer): U3 A5(XTALN)* A8(MCLK/INT2)*; U4 26(GPIO0)* 39(GPIO2)* 49(GPIO3)* 50(NC) 51(NC) 64(NC) 65(NC) 66(NC) 67(NC) 68(NC) 69(NC) 70(NC) 71(NC) 72(NC) 73(NC) 74(NC) 75(NC) 77(GPIO1)*

## Notes on the sheet
- I2C_addr: 0x98
- I2C_addr:\n0x76, 0x7E, 0xC4
- AVCC1v8: max. 126mA\nAVCC3v3: max. 51mA\nDVDD1v8: max. 96mA\nDVDD3v3: max. 90mA
- DVDD1v2: max. 100+40mA\nDVDD3v3: max. 4mA

# Schematic io_analog_av
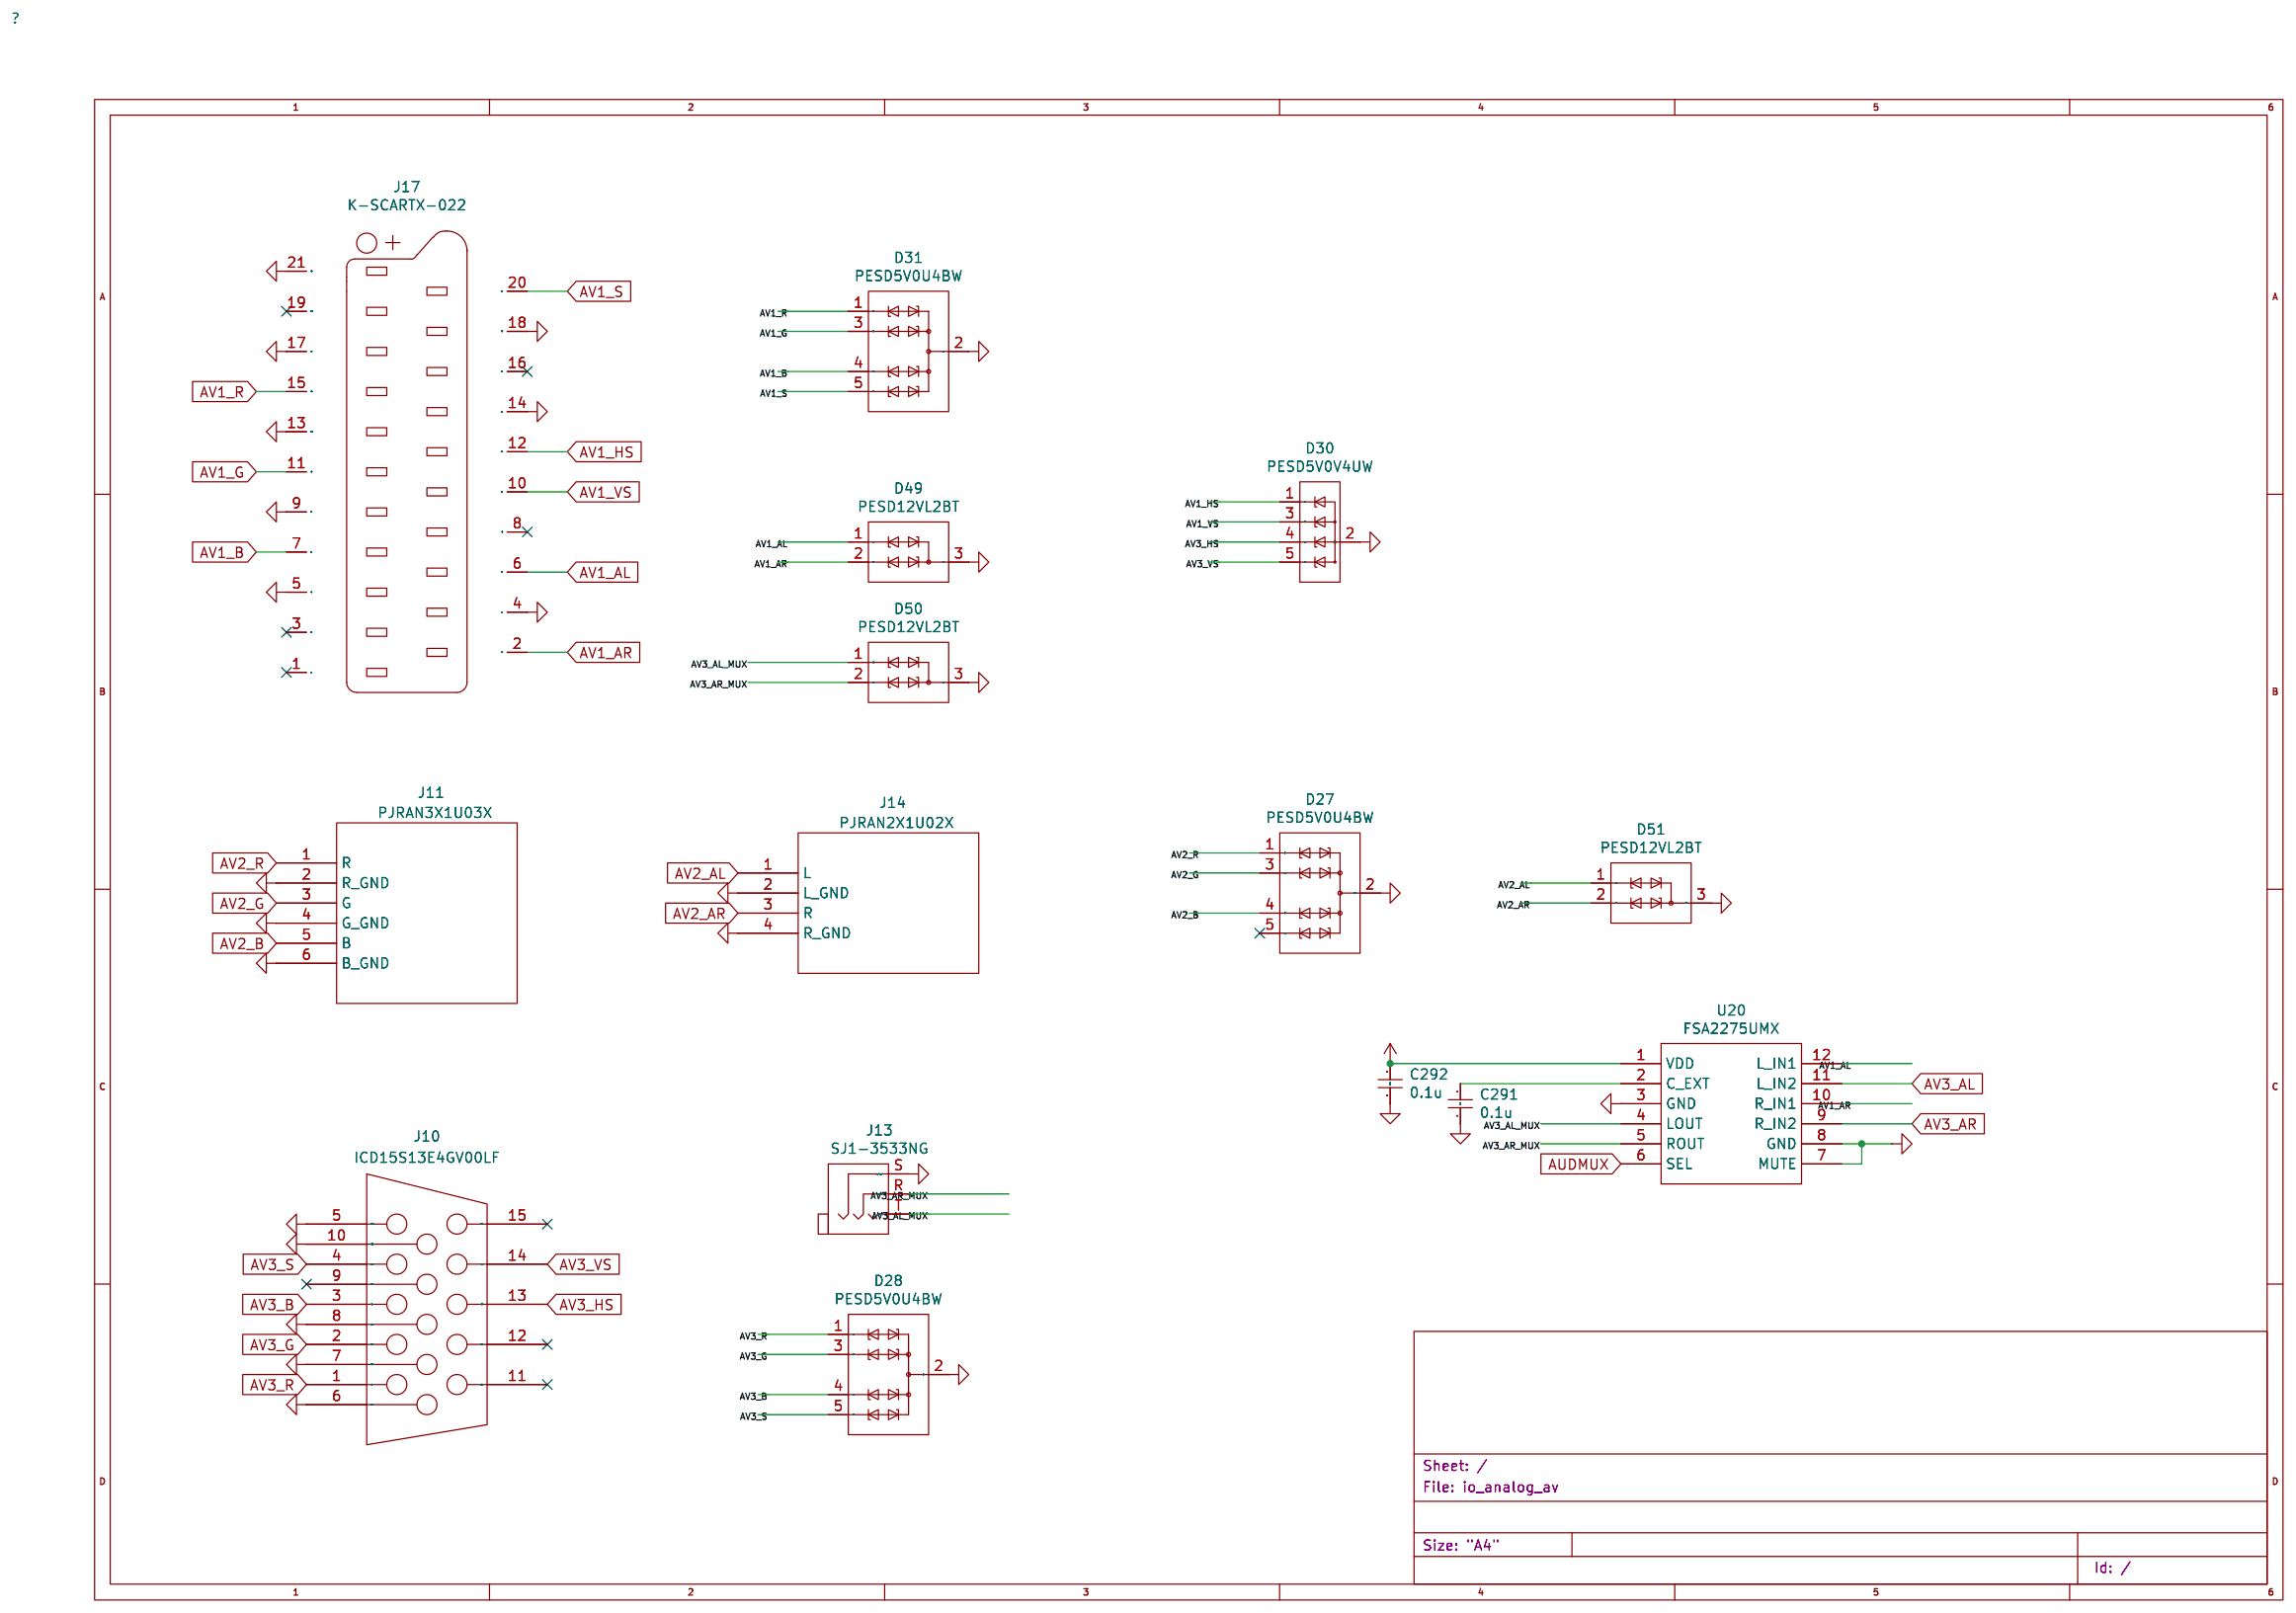
[diagram p11: schematic sheet]

## Parts
C291  0.1u
C292  0.1u
D27  PESD5V0U4BW
D28  PESD5V0U4BW
D30  PESD5V0V4UW
D31  PESD5V0U4BW
D49  PESD12VL2BT
D50  PESD12VL2BT
D51  PESD12VL2BT
J10  ICD15S13E4GV00LF  [custom_components:VGA_CONN]
J11  PJRAN3X1U03X  [custom_components:3xRCA_CONN]
J13  SJ1-3533NG  [Connector_Audio:Jack_3.5mm_CUI_SJ1-3533NG_Horizontal]
J14  PJRAN2X1U02X  [custom_components:2xRCA_CONN]
J17  K-SCARTX-022  [custom_components:SCART_CONN]
U20  FSA2275UMX  [custom_components:FSA2275UMX]

## Library data of the parts
C291 C292 = Device_C_Small
D27 D28 D31 = custom_components_PESD5V0U4BW
D30 = custom_components_PESD5V0V4UW
D49-D51 = custom_components_PESD12VL2BT
J10 = custom_components_VGA
J11 = custom_components_3xRCA_CONN: User doc link: DOCUMENTATION
J13 = Connector_AudioJack3
J14 = custom_components_2xRCA_CONN: User doc link: DOCUMENTATION
J17 = Connector_SCART-F
U20 = custom_components_FSA2275UMX

## Nets
AV1_AL: D49.1(TVS1) J17.6(P6) U20.12(L_IN1)
AV1_AR: D49.2(TVS2) J17.2(P2) U20.10(R_IN1)
AV1_B: D31.4(TVS3) J17.7(P7)
AV1_G: D31.3(TVS2) J17.11(P11)
AV1_HS: D30.1(IO1) J17.12(P12)
AV1_R: D31.1(TVS1) J17.15(P15)
AV1_S: D31.5(TVS4) J17.20(P20)
AV1_VS: D30.3(IO2) J17.10(P10)
AV2_AL: D51.1(TVS1) J14.1(L)
AV2_AR: D51.2(TVS2) J14.3(R)
AV2_B: D27.4(TVS3) J11.5(B)
AV2_G: D27.3(TVS2) J11.3(G)
AV2_R: D27.1(TVS1) J11.1(R)
AV3_AL: U20.11(L_IN2)
AV3_AL_MUX: D50.1(TVS1) J13.T U20.4(LOUT)
AV3_AR: U20.9(R_IN2)
AV3_AR_MUX: D50.2(TVS2) J13.R U20.5(ROUT)
AV3_B: D28.4(TVS3) J10.3(BLUE)
AV3_G: D28.3(TVS2) J10.2(GREEN)
AV3_HS: D30.4(IO3) J10.13(HSYNC)
AV3_R: D28.1(TVS1) J10.1(RED)
AV3_S: D28.5(TVS4) J10.4(ID2/RES)
AV3_VS: D30.5(IO4) J10.14(VSYNC)
AUDMUX: U20.6(SEL)
CUSTOM_COMPONENTS_DVDD3V3: C292.1 U20.1(VDD)
POWER_GND: C291.2 C292.2 D27.2(COM) D28.2(COM) D30.2(GND) D31.2(COM) D49.3(COM) D50.3(COM) D51.3(COM) J10.5(GND_HSYNC) J10.6(RED_RTN) J10.7(GREEN_RTN) J10.8(BLUE_RTN) J10.10(GND_VSYNC) J11.2(R_GND) J11.4(G_GND) J11.6(B_GND) J13.S J14.2(L_GND) J14.4(R_GND) J17.4(P4) J17.5(P5) J17.9(P9) J17.13(P13) J17.14(P14) J17.17(P17) J17.18(P18) J17.21(P21) U20.3(GND) U20.7(MUTE) U20.8(GND)
Net-(C291-1): C291.1 U20.2(C_EXT)

Not connected (* = marked no-connect by the designer): D27 5(TVS4)*; J10 9(KEY/PWR)* 11(ID0/RES)* 12(ID1/SDA)* 15(ID3/SCL)*; J17 1(P1)* 3(P3)* 8(P8)* 16(P16)* 19(P19)*
